# Altium project RCB_WWVB_SDR.PrjPcb (part 1 of 2)
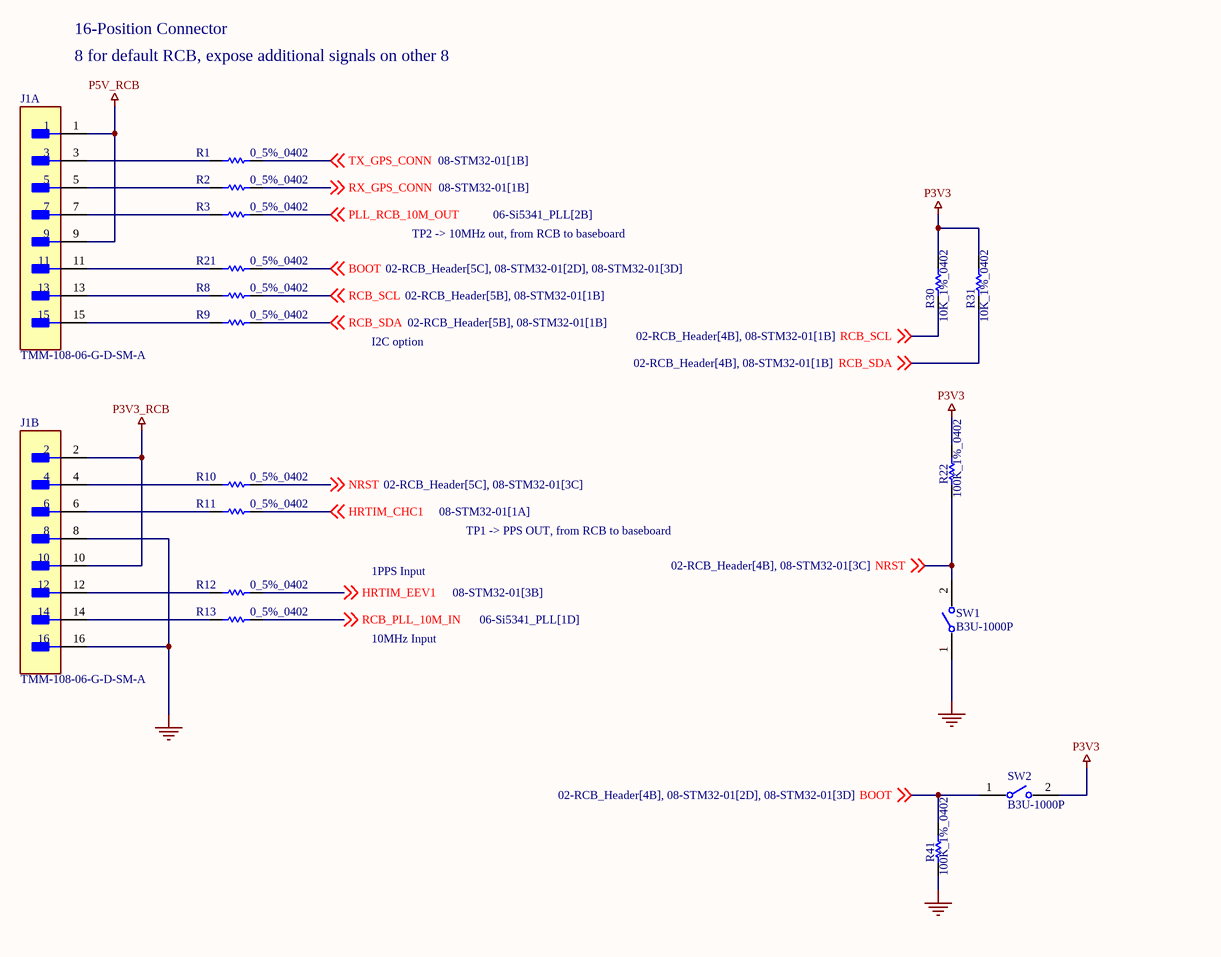
[diagram p0: 02-RCB_Header.SchDoc]
prjCompanyName: Meta Platforms Technologies, LLC.; prjContactAddress1: 9845 Willows Road NE; prjContactAddress2: Redmond, WA 98052; prjContactEmail: Contact Email; prjContactPhone: (...)-...-....; prjElectricalEngineer: Electical Engineer; prjElectricalEngineerEmail: Electical Engineer Email; prjLayoutEngineer: Layout Engineer; prjLayoutEngineerEmail: Layout Engineer Email; prjMechanicalEngineer: Mechanical Engineer; prjMechanicalEngineerEmail: Mechanical Engineer Email; prjPCB_IPN: 844-XXXXX-XX; prjPCB_Name: PCB Name; prjPCB_Revision: X1; prjProjectName: Project Name; prjSchematic_IPN: 846-XXXXX-XX; prjSchematic_Revision: X1; XprjPCBA_IPN: Set v_prjPCBA_IPN in variant parameters; XprjPCBA_Revision: Set v_prjPCBA_Revision in variant parameters
8 sheets, 254 parts. Net scope: global (net labels, ports and power ports of the same name join across sheets).
Board file: RCB_WWVB_SDR_V2.PcbDoc
Sheets:
  02-RCB_Header.SchDoc
  03-WWVB_Path.SchDoc
  04-SX1257.SchDoc
  06-Si5341_PLL.SchDoc
  07-TCXO_Crystal.SchDoc
  09-STM32-02.SchDoc
  11-Ice40_FPGA.SchDoc
  12-Power.SchDoc

## Sheet 02-RCB_Header.SchDoc
size B; SheetNumber: 2; SheetTotal: 12

### Parts
J1  TMM-108-06-G-D-SM-A  [FP-TMM-108-06-G-D-SM-A-MFG]  (parts A,B of 2)
R1  0_5%_0402  [RESC1005X40X25NL05T10]
R2  0_5%_0402  [RESC1005X40X25NL05T10]
R3  0_5%_0402  [RESC1005X40X25NL05T10]
R8  0_5%_0402  [RESC1005X40X25NL05T10]
R9  0_5%_0402  [RESC1005X40X25NL05T10]
R10  0_5%_0402  [RESC1005X40X25NL05T10]
R11  0_5%_0402  [RESC1005X40X25NL05T10]
R12  0_5%_0402  [RESC1005X40X25NL05T10]
R13  0_5%_0402  [RESC1005X40X25NL05T10]
R21  0_5%_0402  [RESC1005X40X25NL05T10]
R22  100K_1%_0402  [RESC1005X40X25ML05T10]
R30  10K_1%_0402  [RESC1005X40X25NL10T10]
R31  10K_1%_0402  [RESC1005X40X25NL10T10]
R41  100K_1%_0402  [RESC1005X40X25ML05T10]
SW1  B3U-1000P  [FP-B3U-1000P-MFG]
SW2  B3U-1000P  [FP-B3U-1000P-MFG]

### Nets
GND: J1.8 J1.16 R41.1 SW1.1
P3V3: R22.2 R30.2 R31.2 SW2.2
P3V3_RCB: J1.2 J1.10
P5V_RCB: J1.1 J1.9
BOOT: R21.2 R41.2 SW2.1 ; off-sheet BOOT
HRTIM_CHC1: R11.2 ; off-sheet HRTIM_CHC1
HRTIM_EEV1: R12.2 ; off-sheet HRTIM_EEV1
NRST: R10.2 R22.1 SW1.2 ; off-sheet NRST
PLL_RCB_10M_OUT: R3.2 ; off-sheet PLL_RCB_10M_OUT
RCB_PLL_10M_IN: R13.2 ; off-sheet RCB_PLL_10M_IN
RCB_SCL: R8.2 R30.1 ; off-sheet RCB_SCL
RCB_SDA: R9.2 R31.1 ; off-sheet RCB_SDA
RX_GPS_CONN: R2.2 ; off-sheet RX_GPS_CONN
TX_GPS_CONN: R1.2 ; off-sheet TX_GPS_CONN
NetJ1_3: J1.3 R1.1
NetJ1_4: J1.4 R10.1
NetJ1_5: J1.5 R2.1
NetJ1_6: J1.6 R11.1
NetJ1_7: J1.7 R3.1
NetJ1_11: J1.11 R21.1
NetJ1_12: J1.12 R12.1
NetJ1_13: J1.13 R8.1
NetJ1_14: J1.14 R13.1
NetJ1_15: J1.15 R9.1

### Notes on the sheet
- 16-Position Connector
- 8 for default RCB, expose additional signals on other 8
- TP2 -> 10MHz out, from RCB to baseboard
- I2C option
- TP1 -> PPS OUT, from RCB to baseboard
- 1PPS Input
- 10MHz Input

### Library data of the parts
J1 = CMP-02766-001527-1: CONN HEADER SMD 16POS 2MM; Max Voltage Rating (AC): 500V; Gender: Male; Number of Contacts: 16; Max Current Rating: 3.9A; RoHS Compliant: Yes; Contact Material: Bronze; Number of Rows: 2; Packaging: Bulk; Length: 16mm; Termination: Solder; Depth: 3.94mm; Max Operating Temperature: 125°C; Housing Color: Black; Radiation Hardening: No; Pitch: 2mm; Orientation: Straight; Contact Plating: Gold; Min Operating Temperature: -55°C; Housing Material: Polymer
R1-R3 R8-R13 R21 = CMP-2002-06457-1: Manufacturer: Panasonic; Part Number: ERJ-U020R00X
R22 R41 = CMP-2002-07852-1: Manufacturer: Yageo; Part Number: RC0402FR-13100KL
R30 R31 = CMP-2002-04694-1: Manufacturer: Bourns; Part Number: CR0402-FX-1002GLF
SW1 SW2 = CMP-2100-03586-2: SWITCH TACTILE SPST-NO 0.05A 12V; Contact Resistance: 100mR; Operating Force: 1.5N; Max Current Rating: 50mA; Switch Travel: 0.15mm; Actuator Type: Standard; Mechanical Life: 200000Cycles; Ratings: Dust Proof; Illumination Type: Non-Illuminated; Throw Configuration: SPST; Actuator Length: 0.4mm; Switch Function: Off-Mom; Height: 1.2mm; Width: 3mm; Weight: 0.000776oz; Contact Material: Silver; Max Voltage Rating (DC): 12V; Insulation Resistance: 100MR; Lead Free: Lead Free; Current Rating: 50mA; Termination: SMD/SMT; Length: 4mm; Voltage Rating (DC): 12V; Contact Current Rating: 50mA; Orientation: Straight; Depth: 2.5mm; Max Operating Temperature: 70°C; Packaging: Tape and Reel; Min Operating Temperature: -25°C; Package Quantity: 1; Mount: Surface Mount; Electrical Life: 200000Cycles

## Sheet 03-WWVB_Path.SchDoc
size B; SheetNumber: 3; SheetTotal: 12
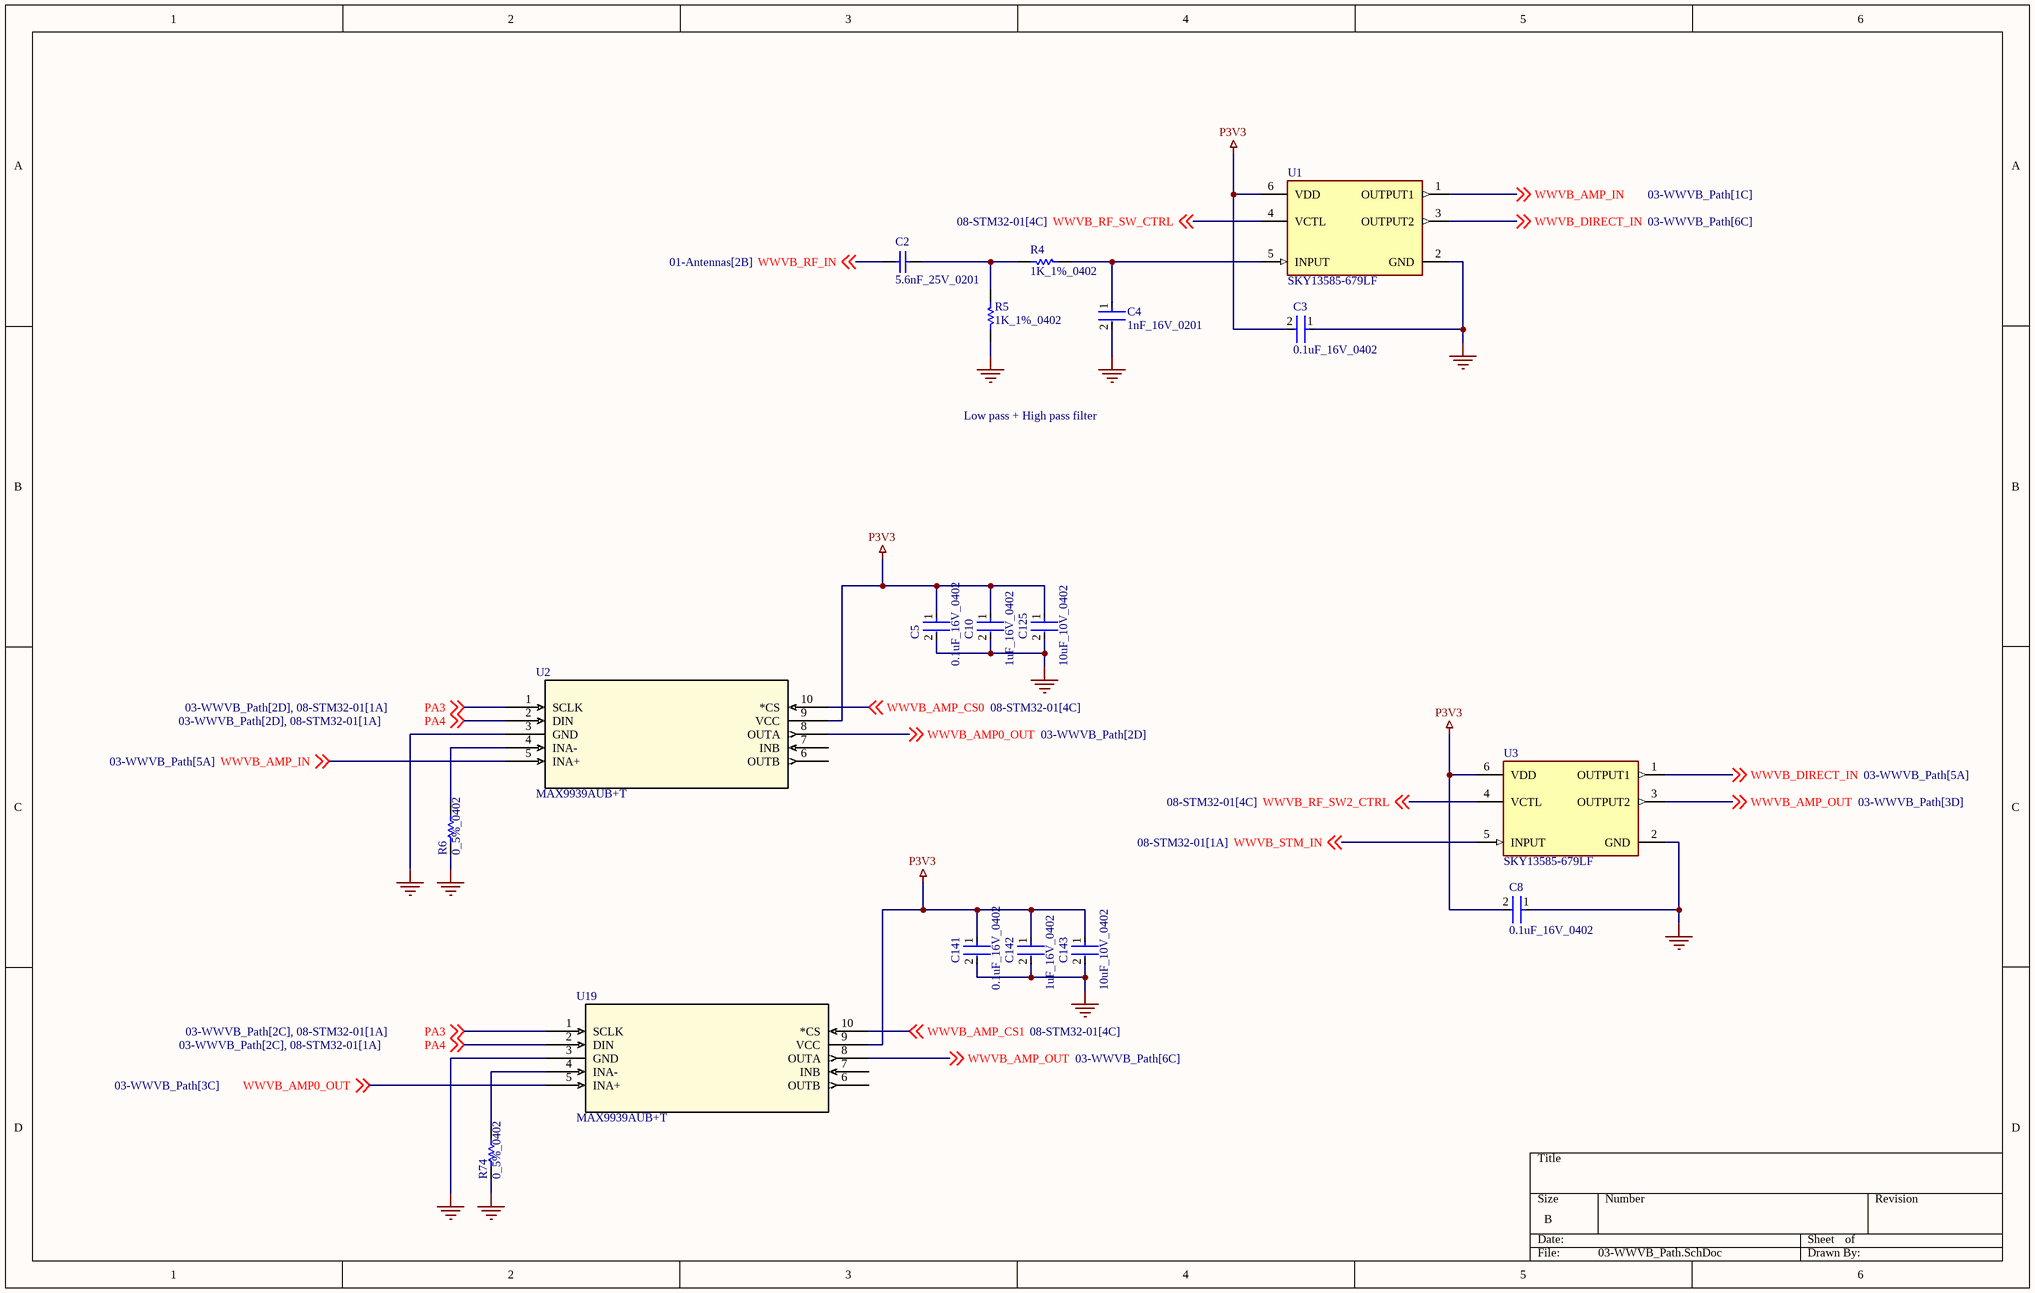
[diagram p1: 03-WWVB_Path.SchDoc]

### Parts
C2  5.6nF_25V_0201  [CAPC0603X33X15ML03T05]
C3  0.1uF_16V_0402  [FP-C0402-BB-MFG]
C4  1nF_16V_0201  [FP-0201-L_0_6_0_09-W_0_3-MFG]
C5  0.1uF_16V_0402  [FP-C0402-BB-MFG]
C8  0.1uF_16V_0402  [FP-C0402-BB-MFG]
C10  1uF_16V_0402  [FP-0402-L_1_0_0_05-W_0_5-IPC_A]
C125  10uF_10V_0402  [FP-CL05A106MP5NUNC-MFG]
C141  0.1uF_16V_0402  [FP-C0402-BB-MFG]
C142  1uF_16V_0402  [FP-0402-L_1_0_0_05-W_0_5-IPC_A]
C143  10uF_10V_0402  [FP-CL05A106MP5NUNC-MFG]
R4  1K_1%_0402  [RESC1005X40X25NL05T05]
R5  1K_1%_0402  [RESC1005X40X25NL05T05]
R6  0_5%_0402  [RESC1005X40X25NL05T10]
R74  0_5%_0402  [RESC1005X40X25NL05T10]
U1  SKY13585-679LF  [FP-SKY13585-679LF-MFG]
U2  MAX9939AUB+T  [21-0061L_MXM]
U3  SKY13585-679LF  [FP-SKY13585-679LF-MFG]
U19  MAX9939AUB+T  [21-0061L_MXM]

### Nets
GND: C3.1 C4.2 C5.2 C8.1 C10.2 C125.2 C141.2 C142.2 C143.2 R5.1 R6.1 R74.1 U1.2(GND) U2.3(GND) U3.2(GND) U19.3(GND)
P3V3: C3.2 C5.1 C8.2 C10.1 C125.1 C141.1 C142.1 C143.1 U1.6(VDD) U2.9(VCC) U3.6(VDD) U19.9(VCC)
PA3: U2.1(SCLK) U19.1(SCLK) ; off-sheet PA3
PA4: U2.2(DIN) U19.2(DIN) ; off-sheet PA4
WWVB_AMP0_OUT: U2.8(OUTA) U19.5(INA+) ; off-sheet WWVB_AMP0_OUT
WWVB_AMP_CS0: U2.10(*CS) ; off-sheet WWVB_AMP_CS0
WWVB_AMP_CS1: U19.10(*CS) ; off-sheet WWVB_AMP_CS1
WWVB_AMP_IN: U1.1(OUTPUT1) U2.5(INA+) ; off-sheet WWVB_AMP_IN
WWVB_AMP_OUT: U3.3(OUTPUT2) U19.8(OUTA) ; off-sheet WWVB_AMP_OUT
WWVB_DIRECT_IN: U1.3(OUTPUT2) U3.1(OUTPUT1) ; off-sheet WWVB_DIRECT_IN
WWVB_RF_IN: C2.1 ; off-sheet WWVB_RF_IN
WWVB_RF_SW2_CTRL: U3.4(VCTL) ; off-sheet WWVB_RF_SW2_CTRL
WWVB_RF_SW_CTRL: U1.4(VCTL) ; off-sheet WWVB_RF_SW_CTRL
WWVB_STM_IN: U3.5(INPUT) ; off-sheet WWVB_STM_IN
NetC2_2: C2.2 R4.2 R5.2
NetC4_1: C4.1 R4.1 U1.5(INPUT)
NetR6_2: R6.2 U2.4(INA-)
NetR74_2: R74.2 U19.4(INA-)

Not connected (* = marked no-connect by the designer): U2 6(OUTB) 7(INB); U19 6(OUTB) 7(INB)

### Notes on the sheet
- Low pass + High pass filter

### Library data of the parts
C2 = CMP-2010-01745-1: Part Number: MC000322; Manufacturer: Multicomp
C3 C5 C8 C141 = CMP-1034-02068-3: CAP CER 0.1UF 16V 5% X7R 0402; Manufacturer: Kemet; Manufacturer Part Number: C0402C104J4RACTU; Value: 0.10 μF; Temperature Coefficient: 15%; Tolerance: 0.05; Material: Ceramic; ComponentLink2URL: https://content.kemet.com/datasheets/KEM_C1002_X7R_SMD.pdf; Automotive: No; Device Class L2: Capacitors; Temperature: -55°C to +125°C; RoHS: TRUE; Voltage Rating: 16 V; ComponentLink2Description: Datasheet; Device Class L3: Ceramic Capacitors; Temperature Range Low: -55°C; Ipc Land Pattern Name: CAPC10050X50; Device Class L1: Passive Components; Temperature Range High: +125°C; Package: C0402-BB; Capacitance: 0.10 μF; Category: Cap; Mouser Description: CAP CER 0.1UF 16V X7R 0402; Height: 0.55mm; Digikey Description: CAP CER 0.1UF 16V 5% X7R 0402; Octopart: https://octopart.com/c0402c104j4ractu-kemet-12573893; Temperature Characteristic: X7R; Lead Free: Yes
C4 = CMP-2010-00182-2: General Purpose Ceramic Capacitor, 0201, 1nF, 10%, X7R, 15%, 16V; Dissipation Factor: 12.5%; Insulation Resistance: 100GR; Lead Free: Lead Free; Thickness: 0.013inch; Height: 0.33mm; Dielectric: X7R; Voltage Rating: 16V; Max Operating Temperature: 125°C; RoHS Compliant: Yes; Voltage: 16V; Package Quantity: 1; Mount: Surface Mount; Voltage Rating (DC): 16V; Dielectric Material: Ceramic; Termination: SMD/SMT; REACH SVHC: No SVHC; Case Code (Metric): 0603; Length: 0.6mm; Case/Package: 0201; Width: 0.012inch; Case Code (Imperial): 0201; Radiation Hardening: No; Tolerance: 10%; Series: -; Number of Pins: 2; Min Operating Temperature: -55°C; Capacitance: 1nF; Construction: Flat; Depth: 0.3mm; Packaging: Tape and Reel
C10 C142 = CMP-14477-000104-2: None; Tolerance: 10%; Voltage Rating: 16V; Dielectric: X5R; Capacitance: 1uF; Packaging: Tape and Reel; Depth: 0.5mm; Mount: Surface Mount; Thickness: 0.022inch; Package Quantity: 1; Min Operating Temperature: -55°C; Series: M; Voltage Rating (DC): 16V; Termination: SMD/SMT; Case/Package: 0402; Number of Pins: 2; Case Code (Imperial): 0402; Length: 1mm; Halogen Free: Halogen Free; Case Code (Metric): 1005; Width: 0.02inch; RoHS Compliant: Yes; Radiation Hardening: No; Max Operating Temperature: 85°C; Height: 0.5mm; Construction: Flat
C125 C143 = CMP-13271-000002-1: CAP CER 10UF 10V X5R 0402; Manufacturer Part Number: CL05A106MP5NUNC; Manufacturer: Samsung; Temperature Coefficient: 15%; Tolerance: 20%; Material: Ceramic; Octopart: https://octopart.com/cl05a106mp5nunc-samsung-22457395; Voltage Rating: 10V; RoHS: TRUE; Value: 10uF; Height: 0.7mm; Digikey Description: CAP CER 10UF 10V X5R 0402; Automotive: No; Package: CL05A106MP5NUNC; Device Class L1: Passive Components; Capacitance: 10uF; Temperature Range High: +85°C; ComponentLink2Description: Datasheet; Device Class L2: Capacitors; Temperature Characteristic: X5R; Temperature: -55°C to +85°C; ComponentLink2URL: http://www.samsungsem.com/kr/support/product-search/mlcc/__icsFiles/afieldfile/2019/05/10/19-CL05A106MP5NUNC.pdf; Device Class L3: Ceramic Capacitors; Category: Cap; Temperature Range Low: -55°C; Ipc Land Pattern Name: CAPC10050X50; Lead Free: Yes
R4 R5 = CMP-2002-08277-1: Manufacturer: Vishay Dale; Part Number: CRCW04021K00FKTD
R6 R74 = CMP-2002-06457-1: as R1 on sheet 02-RCB_Header
U1 U3 = CMP-85923-000009-1: IC RF SWITCH SPDT 6GHZ 6MLPD; Insertion Loss: 0.5dB; Impedance: 50R; IIP3: 56dBm; Test Frequency: 2.5GHz; Packaging: Cut Tape; Throw Configuration: SPDT; Max Operating Temperature: 90°C; RoHS Compliant: Yes; Min Operating Temperature: -40°C; Series: -
U2 U19 = MAX9939AUB+T: No Description Available; Mfr_Name: Analog Devices Inc; Copyright: Copyright (C) 2023 Ultra Librarian. All rights reserved.; Manufacturer_Part_Number: MAX9939AUB+T; RefDes: RefDes; Type: DEV

## Sheet 04-SX1257.SchDoc
size B; SheetNumber: 4; SheetTotal: 12
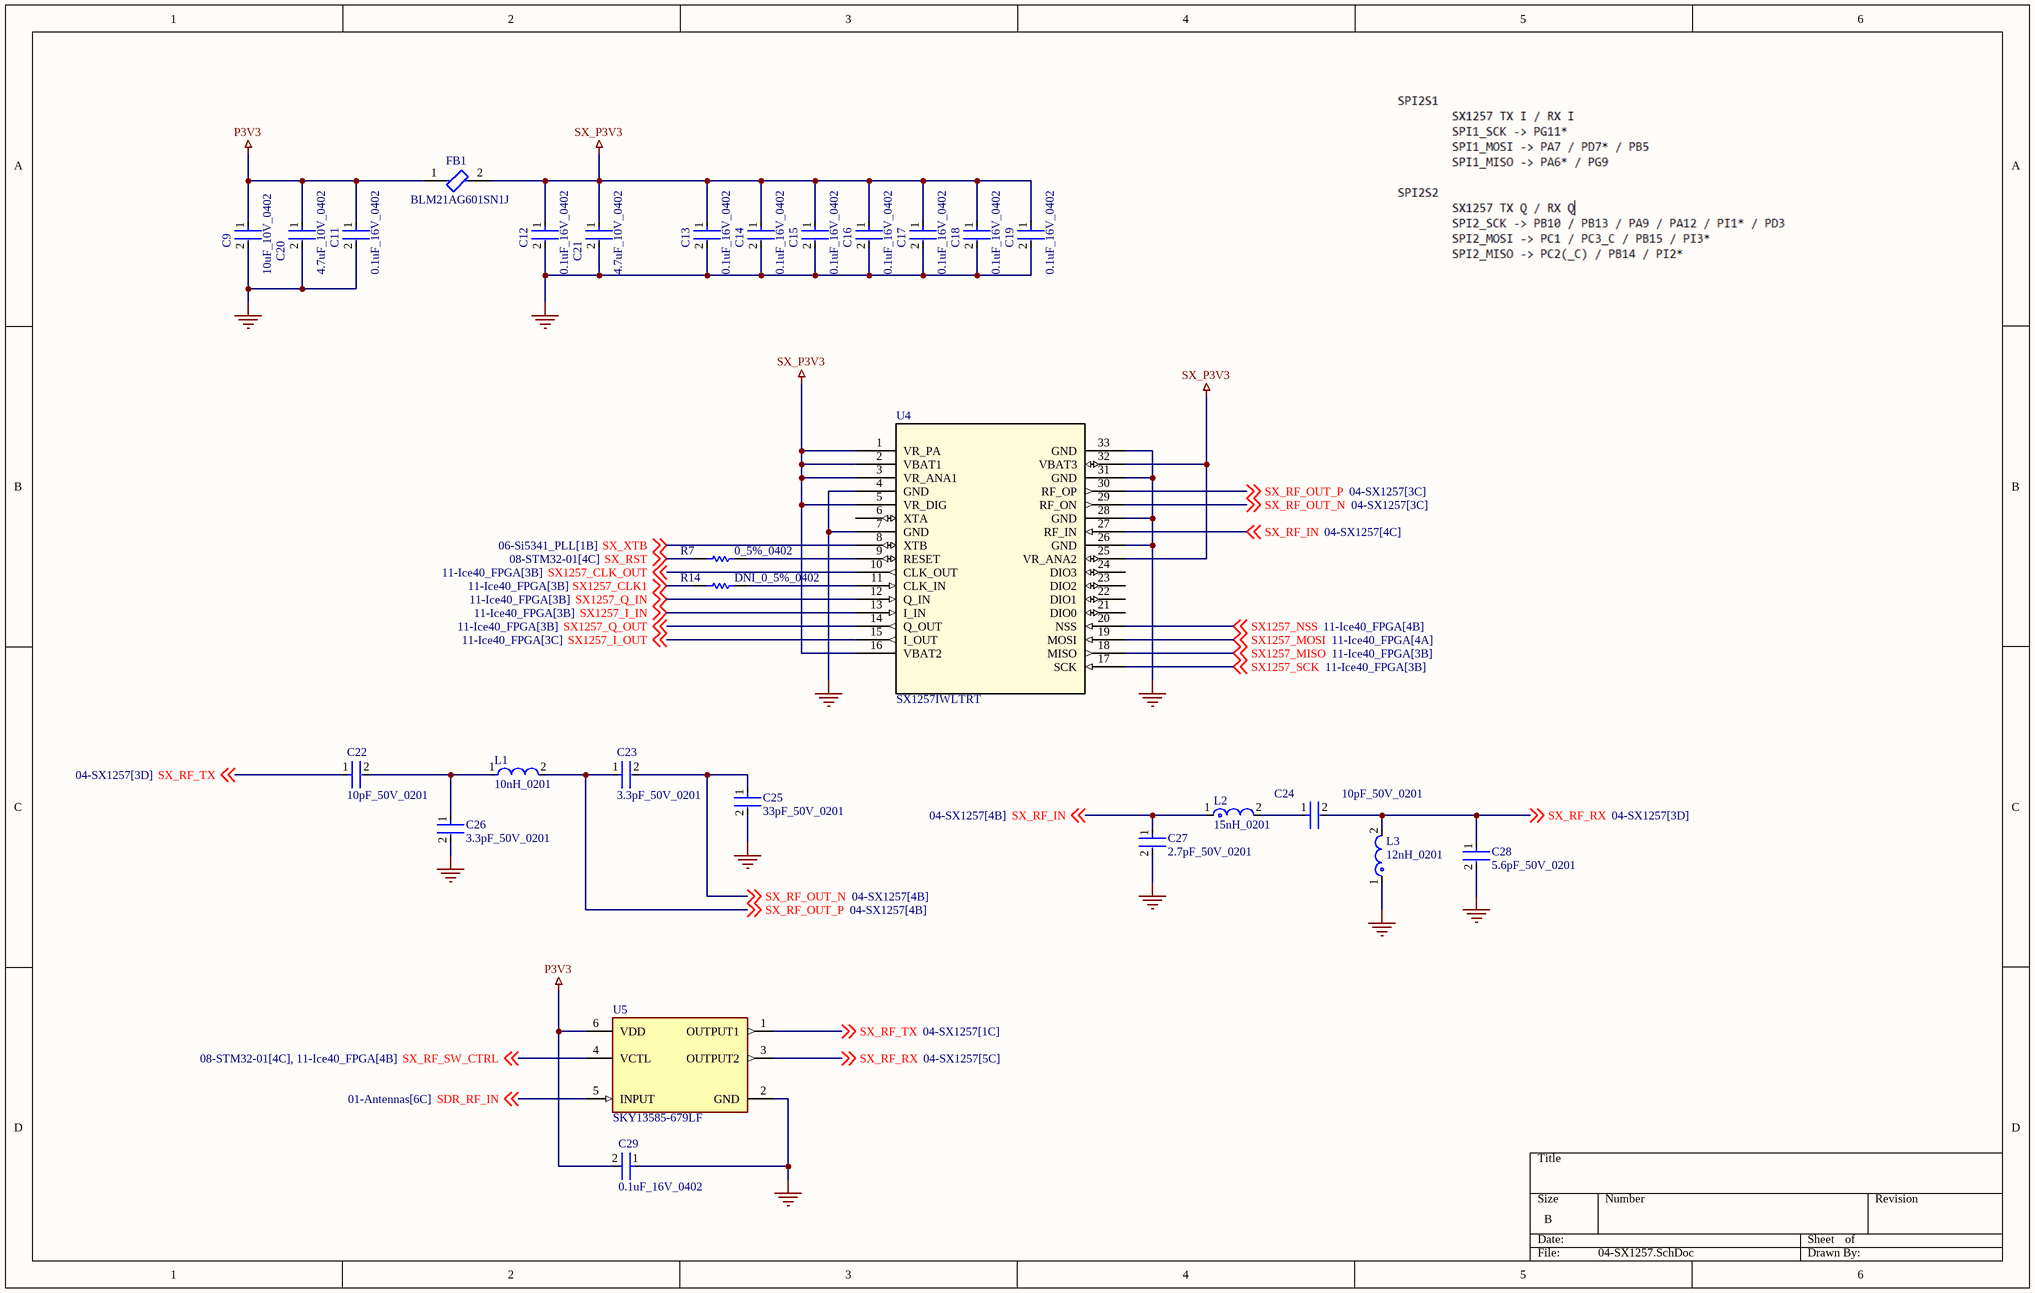
[diagram p2: 04-SX1257.SchDoc]

### Parts
C9  10uF_10V_0402  [FP-CL05A106MP5NUNC-MFG]
C11  0.1uF_16V_0402  [FP-C0402-BB-MFG]
C12  0.1uF_16V_0402  [FP-C0402-BB-MFG]
C13  0.1uF_16V_0402  [FP-C0402-BB-MFG]
C14  0.1uF_16V_0402  [FP-C0402-BB-MFG]
C15  0.1uF_16V_0402  [FP-C0402-BB-MFG]
C16  0.1uF_16V_0402  [FP-C0402-BB-MFG]
C17  0.1uF_16V_0402  [FP-C0402-BB-MFG]
C18  0.1uF_16V_0402  [FP-C0402-BB-MFG]
C19  0.1uF_16V_0402  [FP-C0402-BB-MFG]
C20  4.7uF_10V_0402  [FP-C1005-050-0_15-MFG]
C21  4.7uF_10V_0402  [FP-C1005-050-0_15-MFG]
C22  10pF_50V_0201  [FP-CGA1A-0_1-0_03-MFG]
C23  3.3pF_50V_0201  [FP-GRM033-0_03-IPC_C]
C24  10pF_50V_0201  [FP-CGA1A-0_1-0_03-MFG]
C25  33pF_50V_0201  [FP-CGA1A-0_1-0_03-MFG]
C26  3.3pF_50V_0201  [FP-GRM033-0_03-IPC_C]
C27  2.7pF_50V_0201  [FP-GRM033-0_03-IPC_C]
C28  5.6pF_50V_0201  [FP-GRM033-0_03-MFG]
C29  0.1uF_16V_0402  [FP-C0402-BB-MFG]
FB1  BLM21AG601SN1J  [FP-BLM21-0_2-t0_85-e0_5-IPC_A]
L1  10nH_0201  [FP-LQP03HQ_02-MFG]
L2  15nH_0201  [FP-LQP03TG_02-IPC_C]
L3  12nH_0201  [FP-LQP03TG_02-MFG]
R7  0_5%_0402  [RESC1005X40X25NL05T10]
R14  DNI_0_5%_0402  [RESC1005X40X25NL05T10]  (no BOM)
U4  SX1257IWLTRT  [MLPQW-32_SEM]
U5  SKY13585-679LF  [FP-SKY13585-679LF-MFG]

### Nets
GND: C9.2 C11.2 C12.2 C13.2 C14.2 C15.2 C16.2 C17.2 C18.2 C19.2 C20.2 C21.2 C25.2 C26.2 C27.2 C28.2 C29.1 L3.1 U4.4(GND) U4.7(GND) U4.26(GND) U4.28(GND) U4.31(GND) U4.33(GND) U5.2(GND)
P3V3: C9.1 C11.1 C20.1 C29.2 FB1.1 U5.6(VDD)
SX_P3V3: C12.1 C13.1 C14.1 C15.1 C16.1 C17.1 C18.1 C19.1 C21.1 FB1.2 U4.1(VR_PA) U4.2(VBAT1) U4.3(VR_ANA1) U4.5(VR_DIG) U4.16(VBAT2) U4.25(VR_ANA2) U4.32(VBAT3)
SDR_RF_IN: U5.5(INPUT) ; off-sheet SDR_RF_IN
SX1257_CLK1: R14.1 ; off-sheet SX1257_CLK1
SX1257_CLK_OUT: U4.10(CLK_OUT) ; off-sheet SX1257_CLK_OUT
SX1257_I_IN: U4.13(I_IN) ; off-sheet SX1257_I_IN
SX1257_I_OUT: U4.15(I_OUT) ; off-sheet SX1257_I_OUT
SX1257_MISO: U4.18(MISO) ; off-sheet SX1257_MISO
SX1257_MOSI: U4.19(MOSI) ; off-sheet SX1257_MOSI
SX1257_NSS: U4.20(NSS) ; off-sheet SX1257_NSS
SX1257_Q_IN: U4.12(Q_IN) ; off-sheet SX1257_Q_IN
SX1257_Q_OUT: U4.14(Q_OUT) ; off-sheet SX1257_Q_OUT
SX1257_SCK: U4.17(SCK) ; off-sheet SX1257_SCK
SX_RF_IN: C27.1 L2.1 U4.27(RF_IN) ; off-sheet SX_RF_IN
SX_RF_OUT_N: C23.2 C25.1 U4.29(RF_ON) ; off-sheet SX_RF_OUT_N
SX_RF_OUT_P: C23.1 L1.2 U4.30(RF_OP) ; off-sheet SX_RF_OUT_P
SX_RF_RX: C24.2 C28.1 L3.2 U5.3(OUTPUT2) ; off-sheet SX_RF_RX
SX_RF_SW_CTRL: U5.4(VCTL) ; off-sheet SX_RF_SW_CTRL
SX_RF_TX: C22.1 U5.1(OUTPUT1) ; off-sheet SX_RF_TX
SX_RST: R7.1 ; off-sheet SX_RST
SX_XTB: U4.8(XTB) ; off-sheet SX_XTB
NetC22_2: C22.2 C26.1 L1.1
NetC24_1: C24.1 L2.2
NetR7_2: R7.2 U4.9(RESET)
NetR14_2: R14.2 U4.11(CLK_IN)

Not connected (* = marked no-connect by the designer): U4 6(XTA) 21(DIO0) 22(DIO1) 23(DIO2) 24(DIO3)

### Library data of the parts
C9 = CMP-13271-000002-1: as C125 on sheet 03-WWVB_Path; Octopart: https://octopart.com/cl05a106mp5nunc-samsung-22457395; Voltage Rating: 10V; RoHS: TRUE; Value: 10uF; Height: 0.7mm; Digikey Description: CAP CER 10UF 10V X5R 0402; Automotive: No; Package: CL05A106MP5NUNC; Device Class L1: Passive Components; Capacitance: 10uF; Temperature Range High: +85°C; ComponentLink2Description: Datasheet; Device Class L2: Capacitors; Temperature Characteristic: X5R; Temperature: -55°C to +85°C; ComponentLink2URL: http://www.samsungsem.com/kr/support/product-search/mlcc/__icsFiles/afieldfile/2019/05/10/19-CL05A106MP5NUNC.pdf; Device Class L3: Ceramic Capacitors; Category: Cap; Temperature Range Low: -55°C; Ipc Land Pattern Name: CAPC10050X50; Lead Free: Yes
C11-C19 C29 = CMP-1034-02068-3: as C3 on sheet 03-WWVB_Path; ComponentLink2URL: https://content.kemet.com/datasheets/KEM_C1002_X7R_SMD.pdf; Automotive: No; Device Class L2: Capacitors; Temperature: -55°C to +125°C; RoHS: TRUE; Voltage Rating: 16 V; ComponentLink2Description: Datasheet; Device Class L3: Ceramic Capacitors; Temperature Range Low: -55°C; Ipc Land Pattern Name: CAPC10050X50; Device Class L1: Passive Components; Temperature Range High: +125°C; Package: C0402-BB; Capacitance: 0.10 μF; Category: Cap; Mouser Description: CAP CER 0.1UF 16V X7R 0402; Height: 0.55mm; Digikey Description: CAP CER 0.1UF 16V 5% X7R 0402; Octopart: https://octopart.com/c0402c104j4ractu-kemet-12573893; Temperature Characteristic: X7R; Lead Free: Yes
C20 C21 = CMP-2000-05997-2: CAP CER 4.7UF 10V X5R 0402; Dielectric Material: Ceramic; Tolerance: 10%; Series: C; Package Quantity: 10000; Max Operating Temperature: 85°C; Case Code (Imperial): 0402; Lead Free: Lead Free; Voltage Rating (DC): 10V; Packaging: Cut Tape; Voltage Rating: 10V; Min Operating Temperature: -55°C; Dielectric: X5R; Thickness: 0.022inch; Width: 0.02inch; Case/Package: 0402; Case Code (Metric): 1005; Capacitance: 4.7uF; Length: 0.039inch; RoHS Compliant: Yes; REACH SVHC: No SVHC; Mount: Surface Mount
C22 C24 = CMP-08246-000166-1: Cap Ceramic 10pF 50V C0G 0.5pF Pad SMD 0201 125°C Automotive T/R; Ratings: AEC-Q200; Length: 0.6mm; Height: 0.3mm; Case Code (Imperial): 0201; Package Quantity: 1; Dielectric: C0G; Max Operating Temperature: 125°C; Case Code (Metric): 0603; Packaging: Tape and Reel; Composition: Ceramic; Mount: Surface Mount; Depth: 0.3mm; Min Operating Temperature: -55°C; Voltage Rating (DC): 50V; Case/Package: 0201; Voltage Rating: 50V; Thickness: 0.013inch; Termination: SMD/SMT; Capacitance: 10pF; Width: 0.012inch; Weight: 6E-06oz
C23 C26 = CMP-2010-01117-2: Chip Multilayer Ceramic Capacitors for General Purpose, 0201, 3.3pF, C0G, 30ppm/°C, 0.25pF, 50V; Length: 0.024inch; Dielectric: C0G; Case Code (Imperial): 0201; Min Operating Temperature: -55°C; Mount: Surface Mount; Package Quantity: 50000; Case/Package: 0201; Voltage Rating: 50V; Termination: SMD/SMT; Thickness: 0.013inch; Width: 0.012inch; Capacitance: 3.3pF; Max Operating Temperature: 125°C; Voltage Rating (DC): 50V; Height: 0.3mm; Case Code (Metric): 0603; Packaging: Tape and Reel
C25 = CMP-08246-002436-1: Cap Ceramic 33pF 50V C0G 5% Pad SMD 0201 125°C Automotive T/R; Width: 0.012inch; Height: 0.3mm; Case Code (Imperial): 0201; Depth: 0.3mm; Weight: 6E-06oz; Package Quantity: 1; Mount: Surface Mount; Thickness: 0.013inch; Composition: Ceramic; Packaging: Tape and Reel; Dielectric: C0G; Capacitance: 33pF; Case Code (Metric): 0603; Tolerance: 5%; Length: 0.6mm; Termination: SMD/SMT; Max Operating Temperature: 125°C; Voltage Rating (DC): 50V; Ratings: AEC-Q200; Voltage Rating: 50V; Case/Package: 0201; Min Operating Temperature: -55°C
C27 = CMP-2010-01540-2: Chip Multilayer Ceramic Capacitors for General Purpose, 0201, 2.7pF, C0G, 30ppm/°C, 0.25pF, 50V; Package Quantity: 15000; Max Operating Temperature: 125°C; Dielectric: C0G; Height: 0.3mm; Voltage Rating: 50V; Packaging: Tape and Reel; Length: 0.024inch; Width: 0.012inch; Thickness: 0.013inch; Mount: Surface Mount; Case/Package: 0201; Voltage Rating (DC): 50V; Min Operating Temperature: -55°C; Case Code (Metric): 0603; Case Code (Imperial): 0201; Termination: SMD/SMT; Capacitance: 2.7pF; Lead Free: Lead Free
C28 = CMP-2010-01150-2: Chip Multilayer Ceramic Capacitors for General Purpose, 0201, 5.6pF, C0G, 30ppm/°C, 0.1pF, 50V; Depth: 0.3mm; Length: 0.6mm; Max Operating Temperature: 125°C; Mount: Surface Mount; Width: 0.012inch; Min Operating Temperature: -55°C; Case/Package: 0201; Capacitance: 5.6pF; Dielectric: C0G; Height: 0.3mm; Case Code (Imperial): 0201; Termination: SMD/SMT; Package Quantity: 15000; Case Code (Metric): 0603; Voltage Rating: 50V; Voltage Rating (DC): 50V; Thickness: 0.013inch; Packaging: Tape and Reel
FB1 = CMP-0686-00643-3: Chip Ferrite Bead, 0805, 600Ω @ 100MHz, 0.2Ω, 25%, 700mA; Current Rating: 600mA; Impedance: 600R; DC Resistance (DCR): 210mR; Max Current Rating: 200mA; Number of Circuits: 1; RoHS Compliant: Yes; Test Frequency: 100MHz; Number of Pins: 2; Case Code (Metric): 2012; Depth: 0.85mm; Height: 1.25mm; Case Code (Imperial): 0805; Case/Package: 0805; DC Current: 200mA; Max Operating Temperature: 125°C; Core Material: Ferrite; Length: 2.2mm; Tolerance: 25%; Packaging: Tape and Reel; Min Operating Temperature: -55°C; Radiation Hardening: No; Termination: Flat
L1 = CMP-06042-008104-1: Film type RF Inductor 10nH ±3% 300mA 0.4Ω 0201 (0603); Test Frequency: 500MHz; Shielding: Unshielded; Core Material: Non-Magnetic; DC Resistance (DCR): 400mR; Self Resonant Frequency: 4.5GHz; Packaging: Tape and Reel; Resistor Type: Thin Film; Min Operating Temperature: -55°C; Tolerance: 3%; Case Code (Imperial): 0201; Current Rating: 300mA; Case/Package: 0201; Max Operating Temperature: 125°C; Mount: Surface Mount; Case Code (Metric): 0603; Inductance: 10nH
L2 = CMP-06042-000019-2: Film type RF Inductor 15nH ±5% 250mA 0.7Ω 0201 (0603); Core Material: Non-Magnetic; Shielding: Unshielded; Q Factor: 12; Self Resonant Frequency: 2.6GHz; DC Resistance (DCR): 700mR; Test Frequency: 500MHz; Lead Free: Lead Free; Military Standard: Not; Case Code (Metric): 0603; Tolerance: 5%; Width: 0.3mm; Case/Package: 0201; DC Current: 250mA; Max DC Current: 250mA; Min Operating Temperature: -55°C; Inductance: 15nH; Packaging: Tape and Reel; Depth: 0.33mm; Height: 0.3mm; Termination: SMD/SMT; Package Quantity: 15000; Resistor Type: Thin Film; Case Code (Imperial): 0201; Max Operating Temperature: 125°C; Current Rating: 250mA; Height - Seated (Max): 0.013inch; Mount: Surface Mount; Length: 0.024inch
L3 = CMP-06042-011957-1: Film type RF Inductor 12nH ±5% 250mA 0.7Ω 0201 (0603); Shielding: Unshielded; Test Frequency: 500MHz; Q Factor: 12; Self Resonant Frequency: 2.9GHz; Core Material: Non-Magnetic; DC Resistance (DCR): 700mR; Package Quantity: 15000; Case/Package: 0201; Military Standard: Not; Max Operating Temperature: 125°C; Tolerance: 5%; Height - Seated (Max): 0.013inch; Case Code (Imperial): 0201; Inductance: 12nH; DC Current: 250mA; Depth: 0.33mm; Resistor Type: Thin Film; Length: 0.024inch; Lead Free: Lead Free; Radiation Hardening: No; Height: 0.3mm; Case Code (Metric): 0603; Width: 0.012inch; Mount: Surface Mount; Max DC Current: 250mA; Current Rating: 250mA; Min Operating Temperature: -55°C; Termination: SMD/SMT; Packaging: Tape and Reel
R7 R14 = CMP-2002-06457-1: as R1 on sheet 02-RCB_Header
U4 = SX1257IWLTRT: No Description Available; Mfr_Name: Semtech; Type: DEV; Copyright: Copyright (C) 2023 Ultra Librarian. All rights reserved.; Manufacturer_Part_Number: SX1257IWLTRT; RefDes: RefDes
U5 = CMP-85923-000009-1: as U1 on sheet 03-WWVB_Path; Packaging: Cut Tape; Throw Configuration: SPDT; Max Operating Temperature: 90°C; RoHS Compliant: Yes; Min Operating Temperature: -40°C; Series: -

## Sheet 06-Si5341_PLL.SchDoc
size B; SheetNumber: 6; SheetTotal: 12
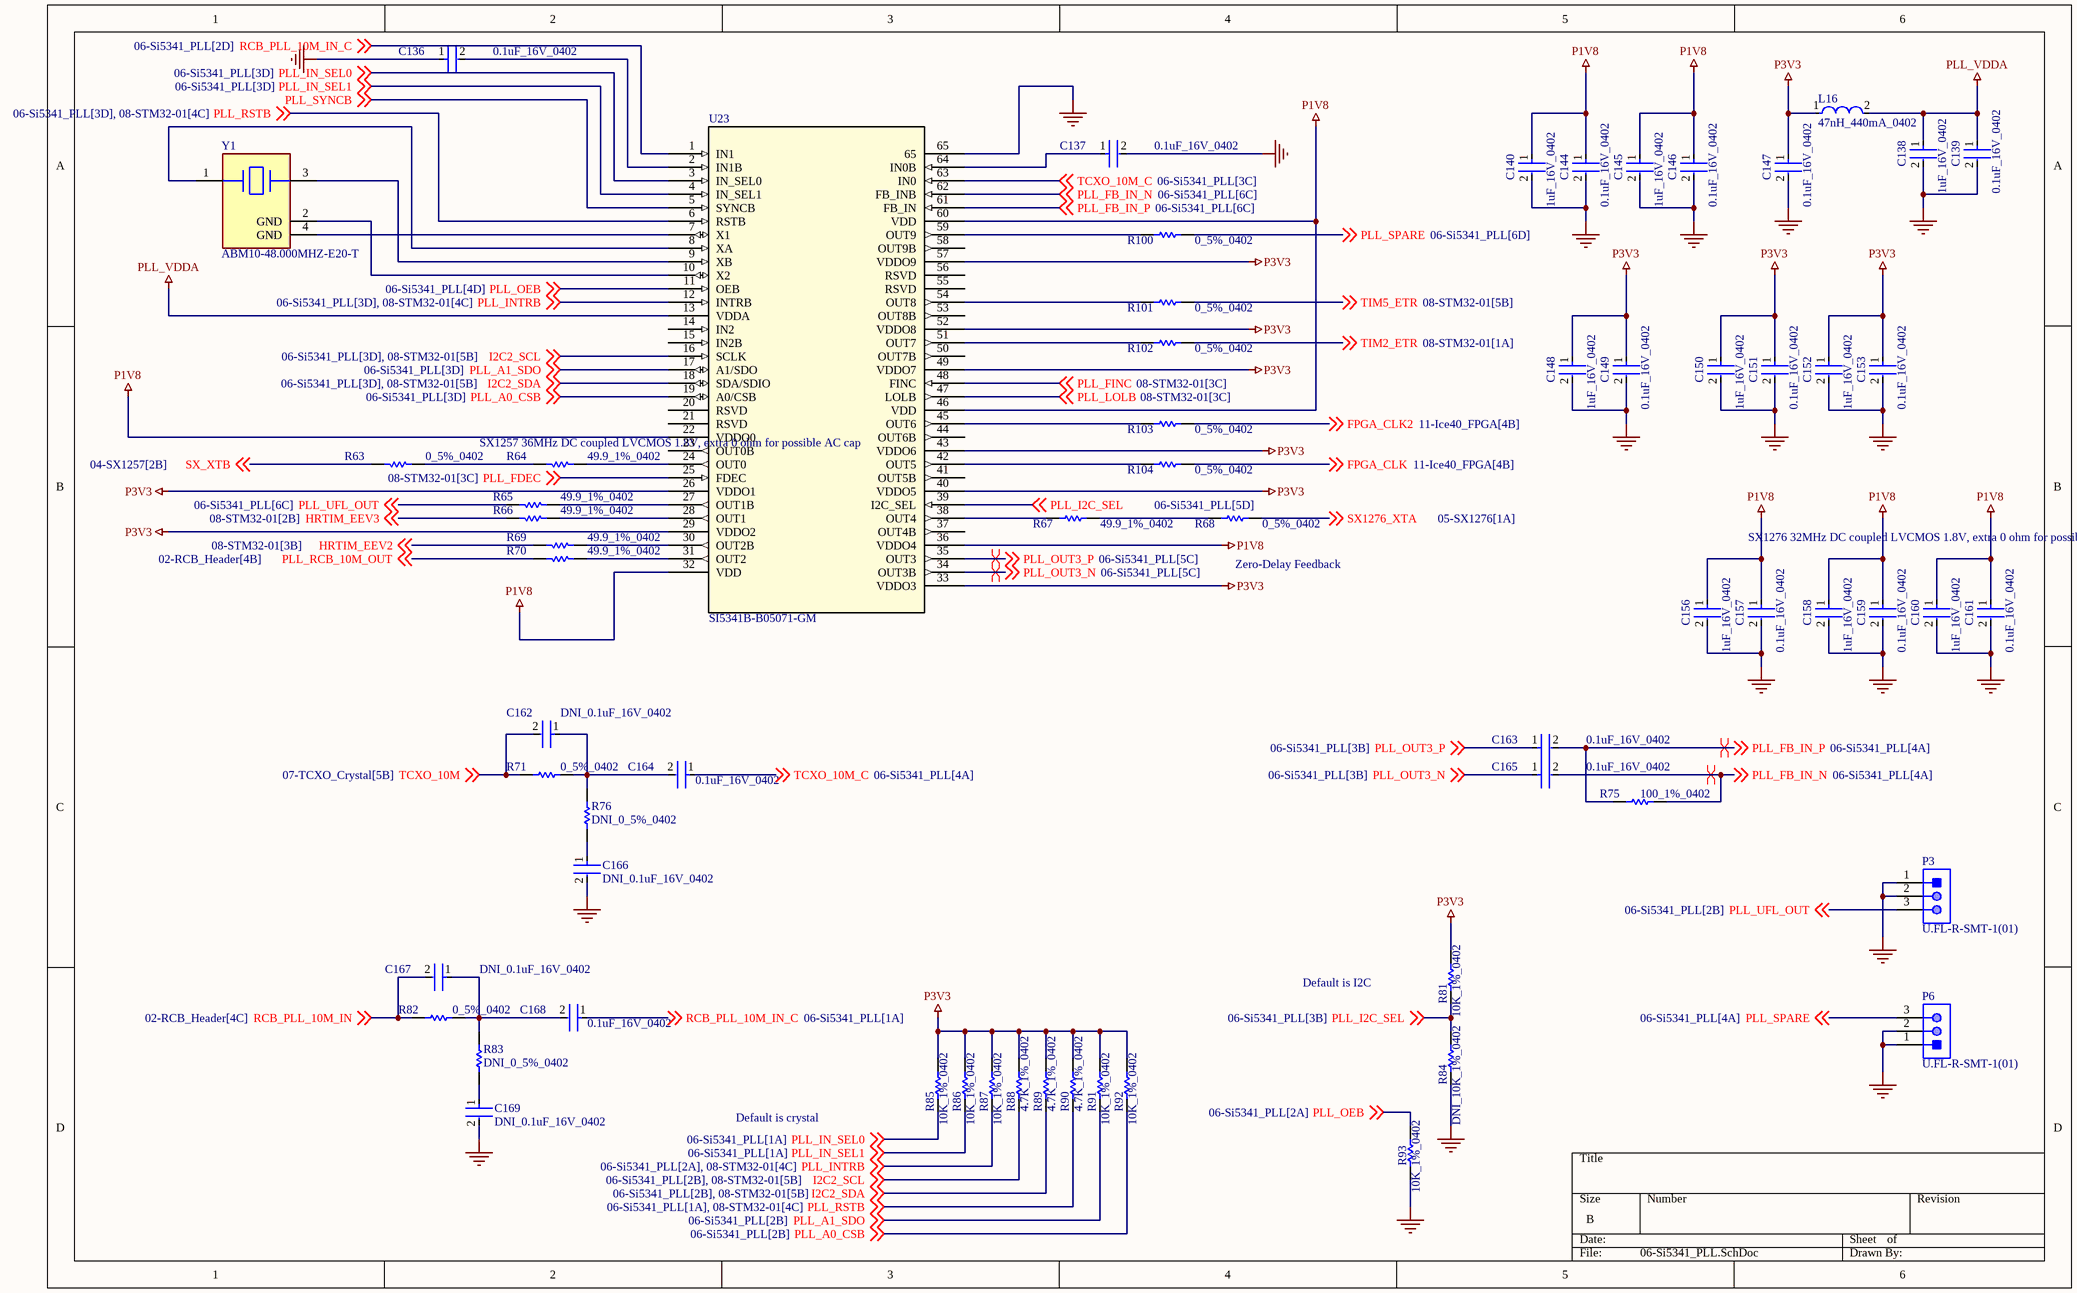
[diagram p3: 06-Si5341_PLL.SchDoc]

### Parts
C136  0.1uF_16V_0402  [FP-C0402-BB-MFG]
C137  0.1uF_16V_0402  [FP-C0402-BB-MFG]
C138  1uF_16V_0402  [FP-0402-L_1_0_0_05-W_0_5-IPC_A]
C139  0.1uF_16V_0402  [FP-C0402-BB-MFG]
C140  1uF_16V_0402  [FP-0402-L_1_0_0_05-W_0_5-IPC_A]
C144  0.1uF_16V_0402  [FP-C0402-BB-MFG]
C145  1uF_16V_0402  [FP-0402-L_1_0_0_05-W_0_5-IPC_A]
C146  0.1uF_16V_0402  [FP-C0402-BB-MFG]
C147  0.1uF_16V_0402  [FP-C0402-BB-MFG]
C148  1uF_16V_0402  [FP-0402-L_1_0_0_05-W_0_5-IPC_A]
C149  0.1uF_16V_0402  [FP-C0402-BB-MFG]
C150  1uF_16V_0402  [FP-0402-L_1_0_0_05-W_0_5-IPC_A]
C151  0.1uF_16V_0402  [FP-C0402-BB-MFG]
C152  1uF_16V_0402  [FP-0402-L_1_0_0_05-W_0_5-IPC_A]
C153  0.1uF_16V_0402  [FP-C0402-BB-MFG]
C156  1uF_16V_0402  [FP-0402-L_1_0_0_05-W_0_5-IPC_A]
C157  0.1uF_16V_0402  [FP-C0402-BB-MFG]
C158  1uF_16V_0402  [FP-0402-L_1_0_0_05-W_0_5-IPC_A]
C159  0.1uF_16V_0402  [FP-C0402-BB-MFG]
C160  1uF_16V_0402  [FP-0402-L_1_0_0_05-W_0_5-IPC_A]
C161  0.1uF_16V_0402  [FP-C0402-BB-MFG]
C162  DNI_0.1uF_16V_0402  [FP-C0402-BB-MFG]  (no BOM)
C163  0.1uF_16V_0402  [FP-C0402-BB-MFG]
C164  0.1uF_16V_0402  [FP-C0402-BB-MFG]
C165  0.1uF_16V_0402  [FP-C0402-BB-MFG]
C166  DNI_0.1uF_16V_0402  [FP-C0402-BB-MFG]  (no BOM)
C167  DNI_0.1uF_16V_0402  [FP-C0402-BB-MFG]  (no BOM)
C168  0.1uF_16V_0402  [FP-C0402-BB-MFG]
C169  DNI_0.1uF_16V_0402  [FP-C0402-BB-MFG]  (no BOM)
L16  47nH_440mA_0402  [FP-LQW15AN_80-MFG]
P3  U.FL-R-SMT-1(01)  [HRS-U.FL-R-SMT-3_V]
P6  U.FL-R-SMT-1(01)  [HRS-U.FL-R-SMT-3_V]
R63  0_5%_0402  [RESC1005X40X25NL05T10]
R64  49.9_1%_0402  [RESC1005X40X25NL10T10]
R65  49.9_1%_0402  [RESC1005X40X25NL10T10]
R66  49.9_1%_0402  [RESC1005X40X25NL10T10]
R67  49.9_1%_0402  [RESC1005X40X25NL10T10]
R68  0_5%_0402  [RESC1005X40X25NL05T10]
R69  49.9_1%_0402  [RESC1005X40X25NL10T10]
R70  49.9_1%_0402  [RESC1005X40X25NL10T10]
R71  0_5%_0402  [RESC1005X40X25NL05T10]
R75  100_1%_0402  [RESC1005X40X25NL05T10]
R76  DNI_0_5%_0402  [RESC1005X40X25NL05T10]  (no BOM)
R81  10K_1%_0402  [RESC1005X40X25NL10T10]
R82  0_5%_0402  [RESC1005X40X25NL05T10]
R83  DNI_0_5%_0402  [RESC1005X40X25NL05T10]  (no BOM)
R84  DNI_10K_1%_0402  [RESC1005X40X25NL10T10]  (no BOM)
R85  10K_1%_0402  [RESC1005X40X25NL10T10]
R86  10K_1%_0402  [RESC1005X40X25NL10T10]
R87  10K_1%_0402  [RESC1005X40X25NL10T10]
R88  4.7K_1%_0402  [RESC1005X40X25NL10T10]
R89  4.7K_1%_0402  [RESC1005X40X25NL10T10]
R90  4.7K_1%_0402  [RESC1005X40X25NL10T10]
R91  10K_1%_0402  [RESC1005X40X25NL10T10]
R92  10K_1%_0402  [RESC1005X40X25NL10T10]
R93  10K_1%_0402  [RESC1005X40X25NL10T10]
R100  0_5%_0402  [RESC1005X40X25NL05T10]
R101  0_5%_0402  [RESC1005X40X25NL05T10]
R102  0_5%_0402  [RESC1005X40X25NL05T10]
R103  0_5%_0402  [RESC1005X40X25NL05T10]
R104  0_5%_0402  [RESC1005X40X25NL05T10]
U23  SI5341B-B05071-GM  [QFN64_SI5341_SIL_SKY]
Y1  ABM10-48.000MHZ-E20-T  [FP-ABM10-MFG]

### Nets
GND: C136.1 C137.2 C138.2 C139.2 C140.2 C144.2 C145.2 C146.2 C147.2 C148.2 C149.2 C150.2 C151.2 C152.2 C153.2 C156.2 C157.2 C158.2 C159.2 C160.2 C161.2 C166.2 C169.2 P3.1 P3.2 P6.1 P6.2 R84.1 R93.1 U23.65
P1V8: C140.1 C144.1 C145.1 C146.1 C156.1 C157.1 C158.1 C159.1 C160.1 C161.1 U23.22(VDDO0) U23.32(VDD) U23.36(VDDO4) U23.46(VDD) U23.60(VDD)
P3V3: C147.1 C148.1 C149.1 C150.1 C151.1 C152.1 C153.1 L16.1 R81.2 R85.2 R86.2 R87.2 R88.2 R89.2 R90.2 R91.2 R92.2 U23.26(VDDO1) U23.29(VDDO2) U23.33(VDDO3) U23.40(VDDO5) U23.43(VDDO6) U23.49(VDDO7) U23.52(VDDO8) U23.57(VDDO9)
PLL_VDDA: C138.1 C139.1 L16.2 U23.13(VDDA)
FPGA_CLK: R104.2 ; off-sheet FPGA_CLK
FPGA_CLK2: R103.2 ; off-sheet FPGA_CLK2
HRTIM_EEV2: R69.1 ; off-sheet HRTIM_EEV2
HRTIM_EEV3: R66.1 ; off-sheet HRTIM_EEV3
I2C2_SCL: R88.1 U23.16(SCLK) ; off-sheet I2C2_SCL
I2C2_SDA: R89.1 U23.18(SDA/SDIO) ; off-sheet I2C2_SDA
PLL_A0_CSB: R92.1 U23.19(A0/CSB) ; off-sheet PLL_A0_CSB
PLL_A1_SDO: R91.1 U23.17(A1/SDO) ; off-sheet PLL_A1_SDO
PLL_FB_IN_N: C165.2 R75.2 U23.62(FB_INB) ; off-sheet PLL_FB_IN_N
PLL_FB_IN_P: C163.2 R75.1 U23.61(FB_IN) ; off-sheet PLL_FB_IN_P
PLL_FDEC: U23.25(FDEC) ; off-sheet PLL_FDEC
PLL_FINC: U23.48(FINC) ; off-sheet PLL_FINC
PLL_I2C_SEL: R81.1 R84.2 U23.39(I2C_SEL) ; off-sheet PLL_I2C_SEL
PLL_IN_SEL0: R85.1 U23.3(IN_SEL0) ; off-sheet PLL_IN_SEL0
PLL_IN_SEL1: R86.1 U23.4(IN_SEL1) ; off-sheet PLL_IN_SEL1
PLL_INTRB: R87.1 U23.12(INTRB) ; off-sheet PLL_INTRB
PLL_LOLB: U23.47(LOLB) ; off-sheet PLL_LOLB
PLL_OEB: R93.2 U23.11(OEB) ; off-sheet PLL_OEB
PLL_OUT3_N: C165.1 U23.34(OUT3B) ; off-sheet PLL_OUT3_N
PLL_OUT3_P: C163.1 U23.35(OUT3) ; off-sheet PLL_OUT3_P
PLL_RCB_10M_OUT: R70.1 ; off-sheet PLL_RCB_10M_OUT
PLL_RSTB: R90.1 U23.6(RSTB) ; off-sheet PLL_RSTB
PLL_SPARE: P6.3 R100.2 ; off-sheet PLL_SPARE
PLL_SYNCB: U23.5(SYNCB) ; off-sheet PLL_SYNCB
PLL_UFL_OUT: P3.3 R65.1 ; off-sheet PLL_UFL_OUT
RCB_PLL_10M_IN: C167.2 R82.1 ; off-sheet RCB_PLL_10M_IN
RCB_PLL_10M_IN_C: C168.1 U23.1(IN1) ; off-sheet RCB_PLL_10M_IN_C
SX1276_XTA: R68.2 ; off-sheet SX1276_XTA
SX_XTB: R63.2 ; off-sheet SX_XTB
TCXO_10M: C162.2 R71.1 ; off-sheet TCXO_10M
TCXO_10M_C: C164.1 U23.63(IN0) ; off-sheet TCXO_10M_C
TIM2_ETR: R102.2 ; off-sheet TIM2_ETR
TIM5_ETR: R101.2 ; off-sheet TIM5_ETR
NetC136_2: C136.2 U23.2(IN1B)
NetC137_1: C137.1 U23.64(IN0B)
NetC162_1: C162.1 C164.2 R71.2 R76.2
NetC166_1: C166.1 R76.1
NetC167_1: C167.1 C168.2 R82.2 R83.2
NetC169_1: C169.1 R83.1
NetR63_1: R63.1 R64.1
NetR64_2: R64.2 U23.24(OUT0)
NetR65_2: R65.2 U23.27(OUT1B)
NetR66_2: R66.2 U23.28(OUT1)
NetR67_1: R67.1 R68.1
NetR67_2: R67.2 U23.38(OUT4)
NetR69_2: R69.2 U23.30(OUT2B)
NetR70_2: R70.2 U23.31(OUT2)
NetR100_1: R100.1 U23.59(OUT9)
NetR101_1: R101.1 U23.54(OUT8)
NetR102_1: R102.1 U23.51(OUT7)
NetR103_1: R103.1 U23.45(OUT6)
NetR104_1: R104.1 U23.42(OUT5)
NetU23_7: U23.7(X1) Y1.4(GND)
NetU23_8: U23.8(XA) Y1.1
NetU23_9: U23.9(XB) Y1.3
NetU23_10: U23.10(X2) Y1.2(GND)

Not connected (* = marked no-connect by the designer): U23 14(IN2) 15(IN2B) 20(RSVD) 21(RSVD) 23(OUT0B) 37(OUT4B) 41(OUT5B) 44(OUT6B) 50(OUT7B) 53(OUT8B) 55(RSVD) 56(RSVD) 58(OUT9B)

### Layout directives
differential pair: PLL_FB_IN_N, PLL_FB_IN_P, PLL_OUT3_N, PLL_OUT3_P

### Notes on the sheet
- (near R63) SX1257 36MHz DC coupled LVCMOS 1.8V, extra 0 ohm for possible AC cap
- (near R68) Zero-Delay Feedback
- SX1276 32MHz DC coupled LVCMOS 1.8V, extra 0 ohm for possible AC cap
- Default is I2C
- Default is crystal

### Library data of the parts
C136 C137 C139 C144 C146 C147 C149 C151 C153 C157 C159 C161-C169 = CMP-1034-02068-3: as C3 on sheet 03-WWVB_Path; ComponentLink2URL: https://content.kemet.com/datasheets/KEM_C1002_X7R_SMD.pdf; Automotive: No; Device Class L2: Capacitors; Temperature: -55°C to +125°C; RoHS: TRUE; Voltage Rating: 16 V; ComponentLink2Description: Datasheet; Device Class L3: Ceramic Capacitors; Temperature Range Low: -55°C; Ipc Land Pattern Name: CAPC10050X50; Device Class L1: Passive Components; Temperature Range High: +125°C; Package: C0402-BB; Capacitance: 0.10 μF; Category: Cap; Mouser Description: CAP CER 0.1UF 16V X7R 0402; Height: 0.55mm; Digikey Description: CAP CER 0.1UF 16V 5% X7R 0402; Octopart: https://octopart.com/c0402c104j4ractu-kemet-12573893; Temperature Characteristic: X7R; Lead Free: Yes
C138 C140 C145 C148 C150 C152 C156 C158 C160 = CMP-14477-000104-2: as C10 on sheet 03-WWVB_Path; Packaging: Tape and Reel; Depth: 0.5mm; Mount: Surface Mount; Thickness: 0.022inch; Package Quantity: 1; Min Operating Temperature: -55°C; Series: M; Voltage Rating (DC): 16V; Termination: SMD/SMT; Case/Package: 0402; Number of Pins: 2; Case Code (Imperial): 0402; Length: 1mm; Halogen Free: Halogen Free; Case Code (Metric): 1005; Width: 0.02inch; RoHS Compliant: Yes; Radiation Hardening: No; Max Operating Temperature: 85°C; Height: 0.5mm; Construction: Flat
L16 = CMP-06042-005115-1: Wire Wound RF Inductor 47nH ±5% 440mA 0.648Ω 0402 (1005); Shielding: Unshielded; Core Material: Non-Magnetic; Test Frequency: 100MHz; Q Factor: 25; DC Resistance (DCR): 648mR; Self Resonant Frequency: 3.2GHz; Width: 0.024inch; Packaging: Tape and Reel; Mount: Surface Mount; Resistor Type: Wirewound; Termination: SMD/SMT; Tolerance: 5%; Case Code (Metric): 1005; Min Operating Temperature: -55°C; Current Rating: 440mA; Height: 0.5mm; Max Operating Temperature: 125°C; Case/Package: 0402; Height - Seated (Max): 0.024inch; Length: 0.039inch; Inductance: 47nH; Case Code (Imperial): 0402; Max DC Current: 440mA; Package Quantity: 1
P3 P6 = CMP-2000-05153-1: Ultra Small Coaxial Connector, 6 GHz, -40 to 90 degC, 3-Pin SMD, RoHS, Bulk; Manufacturer: Hirose Electric; Connector Style: U.FL; Impedance: 50Ohm; Dielectric Material: LiquidCrystalPolymer(LCP); Minimum Quantity: UltraMiniatureCoaxial; Online Catalog: U.FLSeries; Featured Product: HiroseU.FLSeries; Frequency - Max: 6GHz; Other Names: H122041 / U.FL-R-SMT-1(01)-ND; Contact Termination: Solder; Body Material: PhosphorBronze; Connector Type: Jack,MalePin; Body Finish: Silver; Center Contact Plating: Gold; Manufacturer URL: https://www.hirose.com; Family: CoaxialConnectors(RF); Fastening Type: Snap-On; Unit PriceUSD: U.FL; Series: U.FL; Package Reference: U.FL-R-SMT; Packaging: Bulk; Standard Package: 100; Mounting Type: SurfaceMount; Quantity Available: Bulk; Housing Color: Silver; Package Description: 3-Pin Surface Mount Device, Body 2.6 x 2.6 mm; Category: Connectors,Interconnects; Operating Temperature: -40degC~90degC; Center Contact Material: PhosphorBronze; Dynamic Catalog: U.FLSeries; Datasheet URL: https://datasheet.ciiva.com/26945/getdatasheetpartid-475239-26945414.pdf; Datasheet Version: Feb-09; Shield Termination: Solder
R63 R68 R71 R76 R82 R83 R100-R104 = CMP-2002-06457-1: as R1 on sheet 02-RCB_Header
R64-R67 R69 R70 = CMP-2002-04448-1: Part Number: RK73H1ETTP49R9F; Manufacturer: KOA Speer
R75 = CMP-2002-07853-1: Manufacturer: Yageo; Part Number: RC0402FR-13100RL
R81 R84-R87 R91-R93 = CMP-2002-04694-1: as R30 on sheet 02-RCB_Header
R88-R90 = CMP-2002-05217-1: Manufacturer: Bourns; Part Number: CR0402-FX-4701GLF
U23 = SI5341B-B05071-GM: No Description Available; Mfr_Name: Skyworks; Type: DEV; Copyright: Copyright (C) 2023 Ultra Librarian. All rights reserved.; Manufacturer_Part_Number: SI5341B-B05071-GM; RefDes: RefDes
Y1 = CMP-27762-011866-1: Crystal 48MHz ±20ppm 10pF SMD-4 2.5mm x 2mm; ESR (Equivalent Series Resistance): 70R; Frequency Tolerance: 20ppm; Depth: 2mm; Height: 0.02inch; RoHS Compliant: Yes; Lead Free: Lead Free; Case/Package: CSMD; Tolerance: 20ppm; Operating Frequency: 48 MHz; Load Capacitance: 10pF; Package Quantity: 1000; Mount: Surface Mount; Number of Pins: 4; Frequency: 48MHz; Length: 2.5mm; Series Resistance: 70R; Packaging: Tape and Reel; Min Operating Temperature: -20°C; Max Operating Temperature: 70°C; Termination: SMD/SMT; Width: 0.079inch; Frequency Stability: 20ppm; Series: ABM10

## Sheet 07-TCXO_Crystal.SchDoc
size B; SheetNumber: 7; SheetTotal: 12
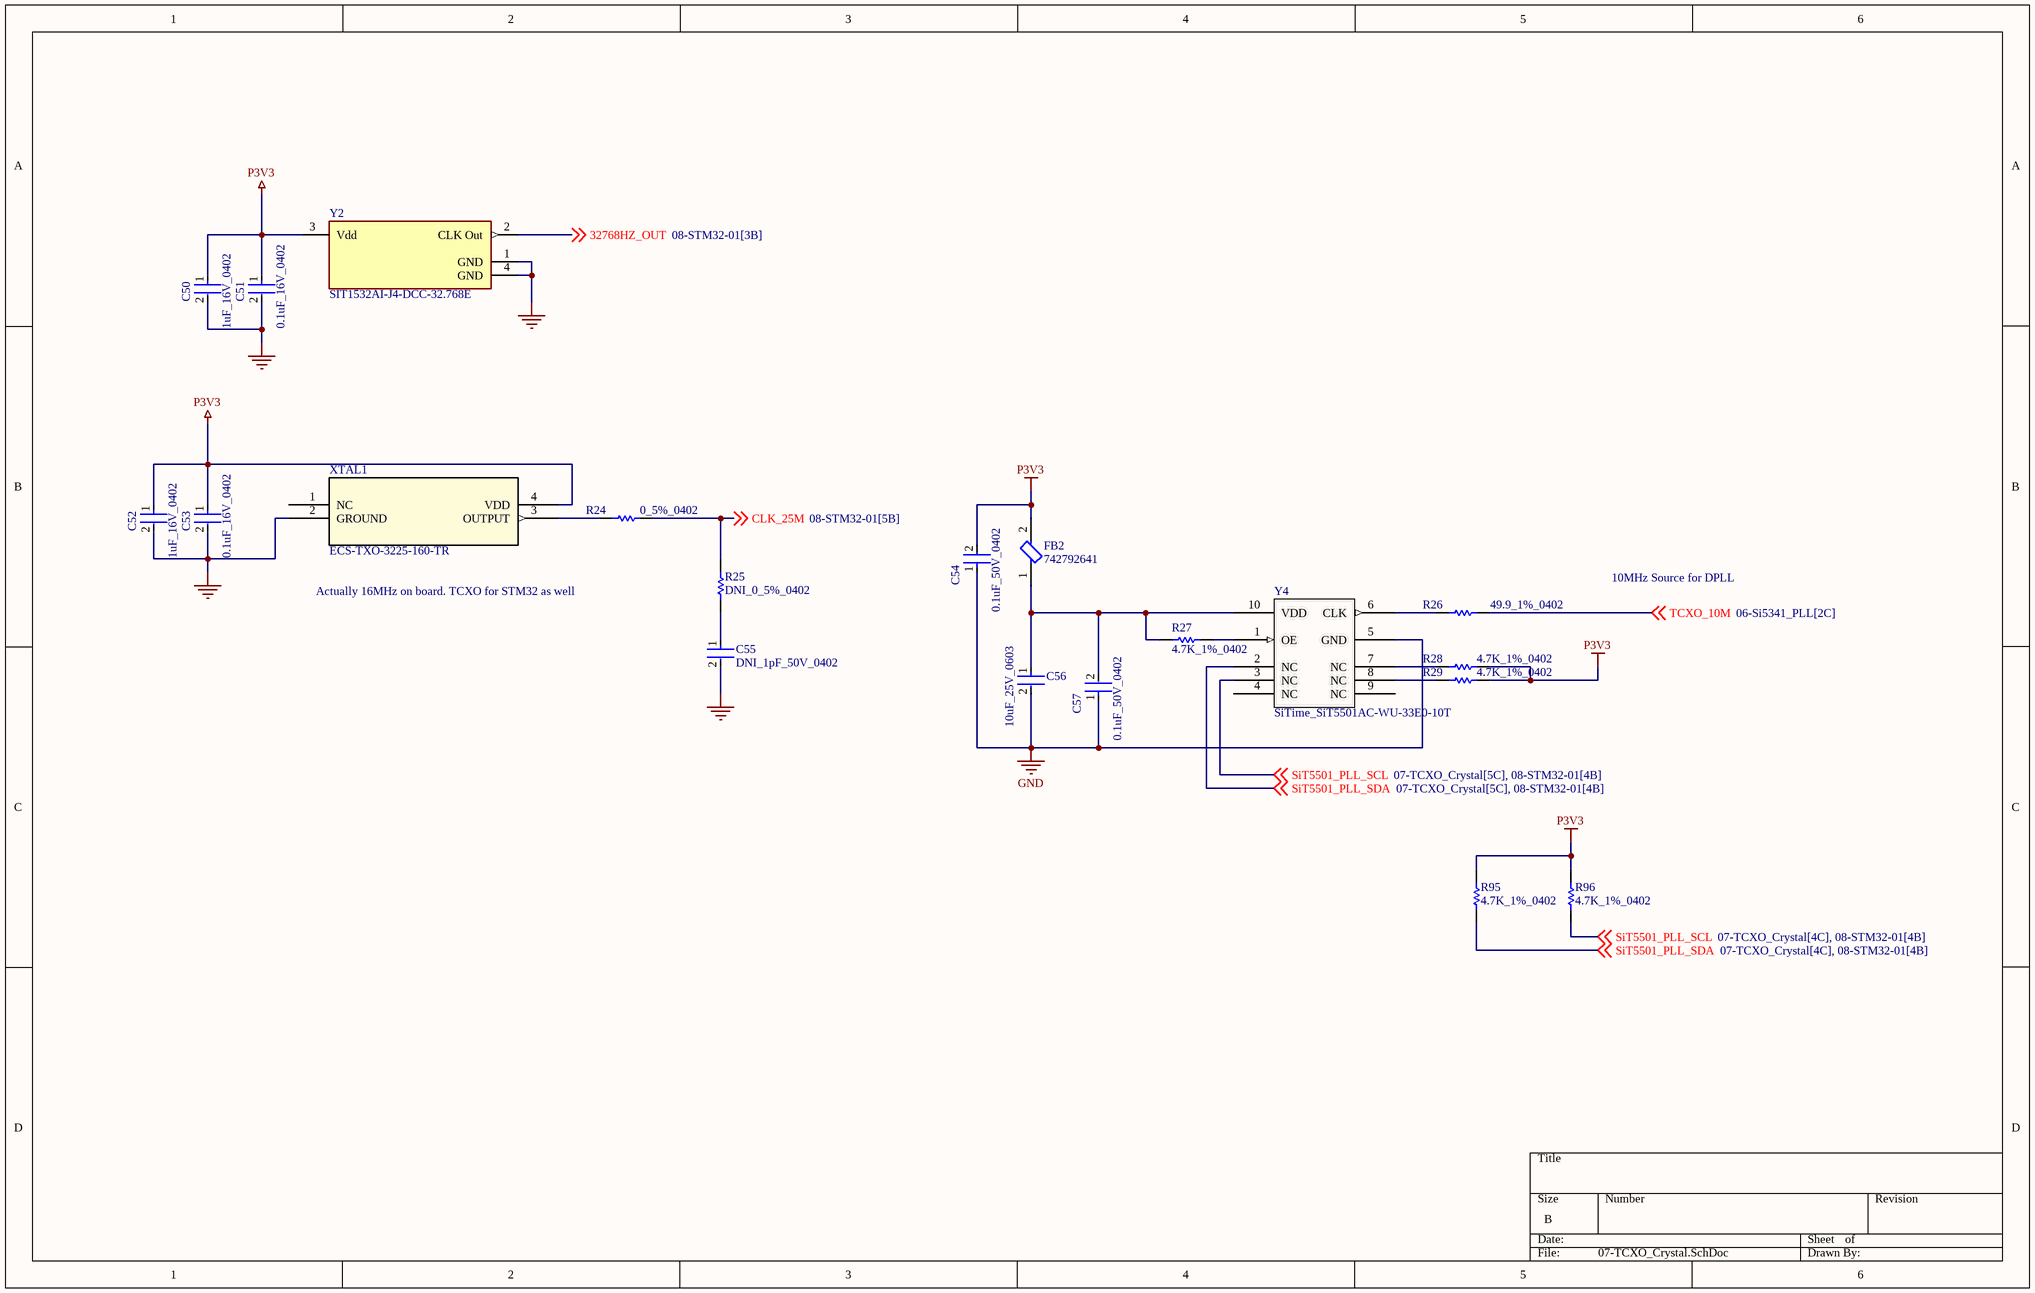
[diagram p4: 07-TCXO_Crystal.SchDoc]

### Parts
C50  1uF_16V_0402  [FP-0402-L_1_0_0_05-W_0_5-IPC_A]
C51  0.1uF_16V_0402  [FP-C0402-BB-MFG]
C52  1uF_16V_0402  [FP-0402-L_1_0_0_05-W_0_5-IPC_A]
C53  0.1uF_16V_0402  [FP-C0402-BB-MFG]
C54  0.1uF_50V_0402  [FP-C1005-050-0_05-IPC_C]
C55  DNI_1pF_50V_0402  [FP-GJM155-0_05-IPC_B]  (no BOM)
C56  10uF_25V_0603  [FP-CL10-IPC_C]
C57  0.1uF_50V_0402  [FP-C1005-050-0_05-IPC_C]
FB2  742792641  [FP-742792641-MFG]
R24  0_5%_0402  [RESC1005X40X25NL05T10]
R25  DNI_0_5%_0402  [RESC1005X40X25NL05T10]  (no BOM)
R26  49.9_1%_0402  [RESC1005X40X25NL10T10]
R27  4.7K_1%_0402  [RESC1005X40X25NL10T10]
R28  4.7K_1%_0402  [RESC1005X40X25NL10T10]
R29  4.7K_1%_0402  [RESC1005X40X25NL10T10]
R95  4.7K_1%_0402  [RESC1005X40X25NL10T10]
R96  4.7K_1%_0402  [RESC1005X40X25NL10T10]
XTAL1  ECS-TXO-3225-160-TR  [ECS-TXO-3225_ECS]
Y2  SIT1532AI-J4-DCC-32.768E  [FP-SIT1532-MFG]
Y4  SiTime_SiT5501AC-WU-33E0-10T  [SITIME_SPL-086-CQFN-010-C07050_REV_DRAFT]

### Nets
GND: C50.2 C51.2 C52.2 C53.2 C54.1 C55.2 C56.2 C57.1 XTAL1.2(GROUND) Y2.1(GND) Y2.4(GND) Y4.5(GND)
P3V3: C50.1 C51.1 C52.1 C53.1 C54.2 FB2.2 R28.2 R29.2 R95.2 R96.2 XTAL1.4(VDD) Y2.3(Vdd)
32768HZ_OUT: Y2.2(CLK_Out) ; off-sheet 32768HZ_OUT
CLK_25M: R24.2 R25.2 ; off-sheet CLK_25M
SiT5501_PLL_SCL: R96.1 Y4.3(NC) ; off-sheet SiT5501_PLL_SCL
SiT5501_PLL_SDA: R95.1 Y4.2(NC) ; off-sheet SiT5501_PLL_SDA
TCXO_10M: R26.1 ; off-sheet TCXO_10M
NetC55_1: C55.1 R25.1
NetC56_1: C56.1 C57.2 FB2.1 R27.1 Y4.10(VDD)
NetR24_1: R24.1 XTAL1.3(OUTPUT)
NetR26_2: R26.2 Y4.6(CLK)
NetR27_2: R27.2 Y4.1(OE)
NetR28_1: R28.1 Y4.7(NC)
NetR29_1: R29.1 Y4.8(NC)

Not connected (* = marked no-connect by the designer): XTAL1 1(NC); Y4 4(NC) 9(NC)

### Notes on the sheet
- Actually 16MHz on board. TCXO for STM32 as well
- 10MHz Source for DPLL

### Library data of the parts
C50 C52 = CMP-14477-000104-2: as C10 on sheet 03-WWVB_Path; Packaging: Tape and Reel; Depth: 0.5mm; Mount: Surface Mount; Thickness: 0.022inch; Package Quantity: 1; Min Operating Temperature: -55°C; Series: M; Voltage Rating (DC): 16V; Termination: SMD/SMT; Case/Package: 0402; Number of Pins: 2; Case Code (Imperial): 0402; Length: 1mm; Halogen Free: Halogen Free; Case Code (Metric): 1005; Width: 0.02inch; RoHS Compliant: Yes; Radiation Hardening: No; Max Operating Temperature: 85°C; Height: 0.5mm; Construction: Flat
C51 C53 = CMP-1034-02068-3: as C3 on sheet 03-WWVB_Path; ComponentLink2URL: https://content.kemet.com/datasheets/KEM_C1002_X7R_SMD.pdf; Automotive: No; Device Class L2: Capacitors; Temperature: -55°C to +125°C; RoHS: TRUE; Voltage Rating: 16 V; ComponentLink2Description: Datasheet; Device Class L3: Ceramic Capacitors; Temperature Range Low: -55°C; Ipc Land Pattern Name: CAPC10050X50; Device Class L1: Passive Components; Temperature Range High: +125°C; Package: C0402-BB; Capacitance: 0.10 μF; Category: Cap; Mouser Description: CAP CER 0.1UF 16V X7R 0402; Height: 0.55mm; Digikey Description: CAP CER 0.1UF 16V 5% X7R 0402; Octopart: https://octopart.com/c0402c104j4ractu-kemet-12573893; Temperature Characteristic: X7R; Lead Free: Yes
C54 C57 = CMP-2000-05393-2: Multilayer Ceramic Capacitors 100nF ±10% 50V X7R SMD 0402; Voltage: 50V; Dielectric Material: Ceramic; Min Operating Temperature: -55°C; Depth: 0.5mm; Radiation Hardening: No; RoHS Compliant: Yes; Voltage Rating (DC): 50V; Lead Free: Lead Free; Resistor Type: Ceramic; Height: 0.5mm; Dielectric: X7R; Thickness: 0.022inch; Case/Package: 0402; Case Code (Metric): 1005; Termination: SMD/SMT; Capacitance: 100nF; Packaging: Tape and Reel; Max Operating Temperature: 125°C; Mount: Surface Mount; Package Quantity: 1; Width: 0.02inch; Weight: 2.3E-05oz; Voltage Rating: 50V; Tolerance: 10%; Construction: Flat; Case Code (Imperial): 0402; Length: 1mm; REACH SVHC: No SVHC; Series: C
C55 = CMP-2008-03808-2: Multi-Layer Ceramic Capacitor 1pF C0G  ±0.1pF 0402 Paper T/R; Temperature Coefficient: 30ppm/°C; Voltage Rating (DC): 50V; REACH SVHC: No SVHC; Packaging: Tape and Reel; Width: 0.02inch; Package Quantity: 10000; Min Operating Temperature: -55°C; Case Code (Imperial): 0402; Lead Pitch: 0.3mm; Capacitance: 1pF; Length: 1mm; Max Operating Temperature: 125°C; Depth: 0.5mm; Thickness: 0.022inch; Case Code (Metric): 1005; Lead Free: Lead Free; Voltage: 50V; Mount: Surface Mount; Number of Pins: 2; Termination: SMD/SMT; Radiation Hardening: No; Dielectric: C0G; Case/Package: 0402; Voltage Rating: 50V; Height: 0.5mm
C56 = CMP-13271-004224-1: Cap Ceramic 10uF 25V X5R ±20% Pad SMD 0603 +85°C T/R; Width: 0.031inch; Voltage Rating: 25V; Length: 0.063inch; Case Code (Metric): 1608; Dielectric: X5R; Termination: Wraparound; Capacitance: 10uF; Lead Free: Lead Free; Mount: Surface Mount; Package Quantity: 1; Case Code (Imperial): 0603; Thickness: 0.035inch; Packaging: Tape and Reel; Contact Plating: Tin; Min Operating Temperature: -55°C; Tolerance: 20%; Max Operating Temperature: 85°C; Case/Package: 0603
FB2 = CMP-0220-00171-2: FERRITE BEAD 300 OHM 0603 1LN; Inductance: 18nH; Max DC Current: 2A; Number of Lines: 1; Test Frequency: 100MHz; Impedance: 300R; DC Resistance (DCR): 150mR; Tolerance: 25%; Case Code (Metric): 1608; Core Material: Ferrite; Length: 1.6mm; Lead Free: Lead Free; Series: WE-CBF; Min Operating Temperature: -55°C; RoHS Compliant: Yes; Case/Package: SMD/SMT; Material: Ferrite; Max Operating Temperature: 125°C; Termination: SMD/SMT; Packaging: Tape and Reel; Weight: 0.000141oz; Case Code (Imperial): 0603; Width: 0.8mm; Mount: Surface Mount; Max Current Rating: 2A; Package Quantity: 1; Depth: 0.8mm; Current Rating: 2A; Height: 0.8mm
R24 R25 = CMP-2002-06457-1: as R1 on sheet 02-RCB_Header
R26 = CMP-2002-04448-1: as R64 on sheet 06-Si5341_PLL
R27-R29 R95 R96 = CMP-2002-05217-1: as R88 on sheet 06-Si5341_PLL
XTAL1 = ECS-TXO-3225-122.8-TR: No Description Available; Mfr_Name: ECS International; RefDes: RefDes; Type: Type; Supplier 1: Newark; Supplier Part Number 1: 54AK5779
Y2 = CMP-25159-261190-1: MEMS OSC XO 32.7680KHZ LVCMOS; Max Supply Voltage: 3.63V; Current Rating: 1.35uA; Frequency Stability: 100ppm; Frequency: 32.768kHz; Max Supply Current: 1.4uA; Load Capacitance: 10pF; Max Duty Cycle: 52%; Min Supply Voltage: 1.5V; Length: 1.5mm; Max Operating Temperature: 85°C; Packaging: Tape and Reel; Termination: SMD/SMT; Min Operating Temperature: -40°C; RoHS Compliant: Yes; Width: 0.8mm; Package Quantity: 1000; Lead Free: Lead Free; Mount: Surface Mount; Height: 0.6mm; Series: SiT1532
Y4 = CMP-OSC-00029-2: OSC, MEMS, STRATUM 3E, 10.000MHZ, 10PPB STAB, LVCMOS, 3.3V, O/P EN, 7.0X5.0X2.2MM, CQFN-10; Manufacturer Part Number: SiT5501AI-WU033JH-10.000000; Manufacturer: SiTime; Frequency: 10 MHz; Voltage - Supply: 3.3 V; Type: OCXO; Category: Oscillators; Max Operating Temperature: 70°C; Min Operating Temperature: -20°C; Height: 2.20mm (max); Case/Package: 10 Lead QFN; Output: LVCMOS; Mounting Type: Surface Mount; Frequency Stability: ±10 ppb; RoHS: Yes

## Sheet 09-STM32-02.SchDoc
size B; SheetNumber: 9; SheetTotal: 12
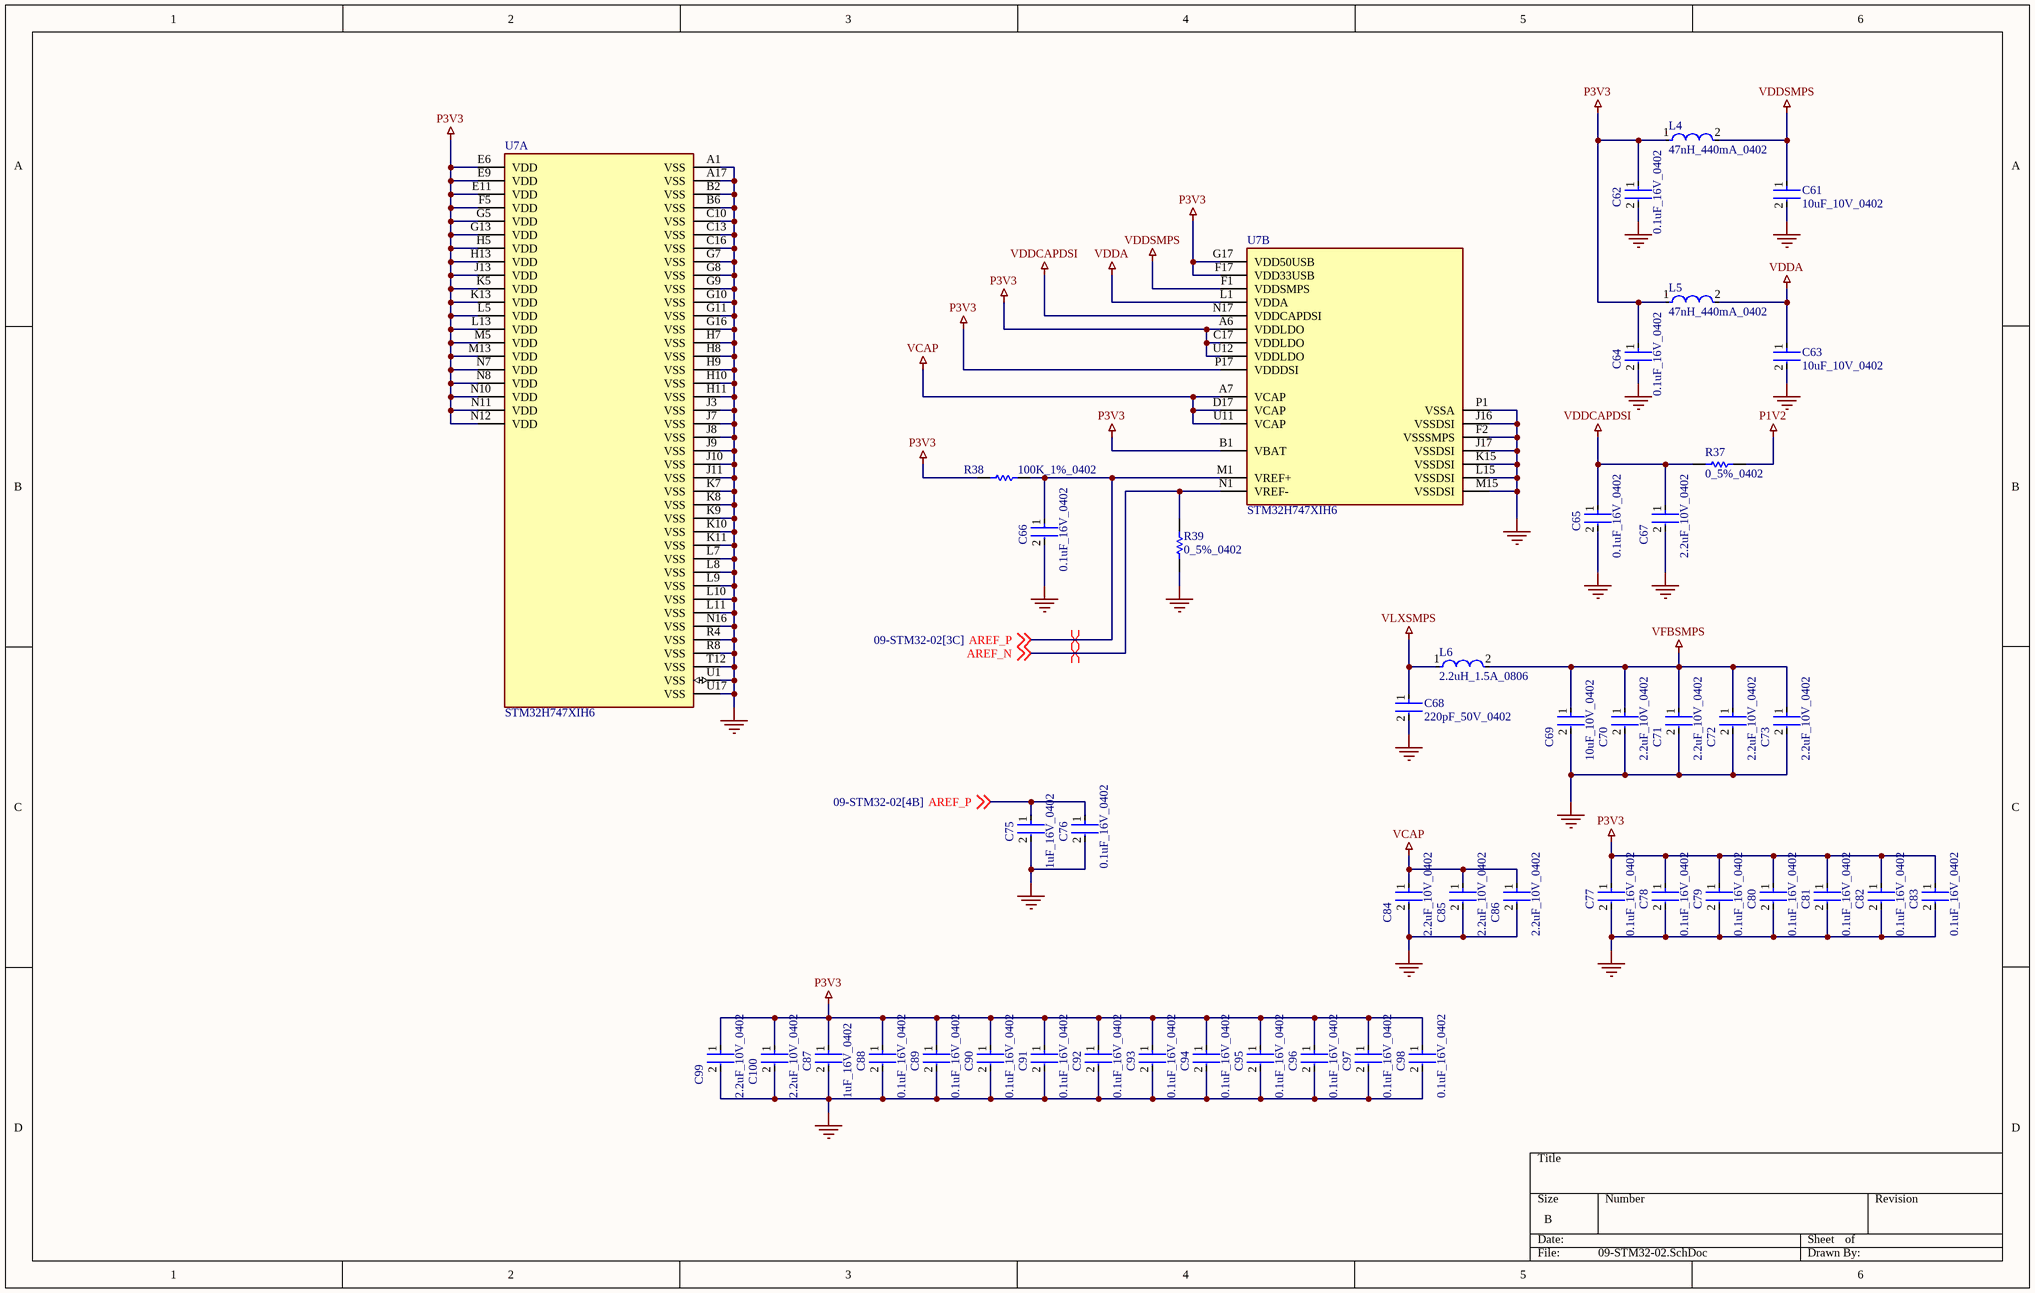
[diagram p5: 09-STM32-02.SchDoc]

### Parts
C61  10uF_10V_0402  [FP-CL05A106MP5NUNC-MFG]
C62  0.1uF_16V_0402  [FP-C0402-BB-MFG]
C63  10uF_10V_0402  [FP-CL05A106MP5NUNC-MFG]
C64  0.1uF_16V_0402  [FP-C0402-BB-MFG]
C65  0.1uF_16V_0402  [FP-C0402-BB-MFG]
C66  0.1uF_16V_0402  [FP-C0402-BB-MFG]
C67  2.2uF_10V_0402  [FP-C1005-050-0_15-0_1-MFG]
C68  220pF_50V_0402  [FP-GCM155-0_05-IPC_C]
C69  10uF_10V_0402  [FP-CL05A106MP5NUNC-MFG]
C70  2.2uF_10V_0402  [FP-C1005-050-0_15-0_1-MFG]
C71  2.2uF_10V_0402  [FP-C1005-050-0_15-0_1-MFG]
C72  2.2uF_10V_0402  [FP-C1005-050-0_15-0_1-MFG]
C73  2.2uF_10V_0402  [FP-C1005-050-0_15-0_1-MFG]
C75  1uF_16V_0402  [FP-0402-L_1_0_0_05-W_0_5-IPC_A]
C76  0.1uF_16V_0402  [FP-C0402-BB-MFG]
C77  0.1uF_16V_0402  [FP-C0402-BB-MFG]
C78  0.1uF_16V_0402  [FP-C0402-BB-MFG]
C79  0.1uF_16V_0402  [FP-C0402-BB-MFG]
C80  0.1uF_16V_0402  [FP-C0402-BB-MFG]
C81  0.1uF_16V_0402  [FP-C0402-BB-MFG]
C82  0.1uF_16V_0402  [FP-C0402-BB-MFG]
C83  0.1uF_16V_0402  [FP-C0402-BB-MFG]
C84  2.2uF_10V_0402  [FP-C1005-050-0_15-0_1-MFG]
C85  2.2uF_10V_0402  [FP-C1005-050-0_15-0_1-MFG]
C86  2.2uF_10V_0402  [FP-C1005-050-0_15-0_1-MFG]
C87  1uF_16V_0402  [FP-0402-L_1_0_0_05-W_0_5-IPC_A]
C88  0.1uF_16V_0402  [FP-C0402-BB-MFG]
C89  0.1uF_16V_0402  [FP-C0402-BB-MFG]
C90  0.1uF_16V_0402  [FP-C0402-BB-MFG]
C91  0.1uF_16V_0402  [FP-C0402-BB-MFG]
C92  0.1uF_16V_0402  [FP-C0402-BB-MFG]
C93  0.1uF_16V_0402  [FP-C0402-BB-MFG]
C94  0.1uF_16V_0402  [FP-C0402-BB-MFG]
C95  0.1uF_16V_0402  [FP-C0402-BB-MFG]
C96  0.1uF_16V_0402  [FP-C0402-BB-MFG]
C97  0.1uF_16V_0402  [FP-C0402-BB-MFG]
C98  0.1uF_16V_0402  [FP-C0402-BB-MFG]
C99  2.2uF_10V_0402  [FP-C1005-050-0_15-0_1-MFG]
C100  2.2uF_10V_0402  [FP-C1005-050-0_15-0_1-MFG]
L4  47nH_440mA_0402  [FP-LQW15AN_80-MFG]
L5  47nH_440mA_0402  [FP-LQW15AN_80-MFG]
L6  2.2uH_1.5A_0806  [FP-DFE201612C-MFG]
R37  0_5%_0402  [RESC1005X40X25NL05T10]
R38  100K_1%_0402  [RESC1005X40X25ML05T10]
R39  0_5%_0402  [RESC1005X40X25NL05T10]
U7  STM32H747XIH6  [FP-TFBGA240+25-A07U-MFG]  (parts A,B of 5)

### Nets
GND: C61.2 C62.2 C63.2 C64.2 C65.2 C66.2 C67.2 C68.2 C69.2 C70.2 C71.2 C72.2 C73.2 C75.2 C76.2 C77.2 C78.2 C79.2 C80.2 C81.2 C82.2 C83.2 C84.2 C85.2 C86.2 C87.2 C88.2 C89.2 C90.2 C91.2 C92.2 C93.2 C94.2 C95.2 C96.2 C97.2 C98.2 C99.2 C100.2 R39.1 U7.A1(VSS) U7.A17(VSS) U7.B2(VSS) U7.B6(VSS) U7.C10(VSS) U7.C13(VSS) U7.C16(VSS) U7.F2(VSSSMPS) U7.G7(VSS) U7.G8(VSS) U7.G9(VSS) U7.G10(VSS) U7.G11(VSS) U7.G16(VSS) U7.H7(VSS) U7.H8(VSS) U7.H9(VSS) U7.H10(VSS) U7.H11(VSS) U7.J3(VSS) U7.J7(VSS) U7.J8(VSS) U7.J9(VSS) U7.J10(VSS) U7.J11(VSS) U7.J16(VSSDSI) U7.J17(VSSDSI) U7.K7(VSS) U7.K8(VSS) U7.K9(VSS) U7.K10(VSS) U7.K11(VSS) U7.K15(VSSDSI) U7.L7(VSS) U7.L8(VSS) U7.L9(VSS) U7.L10(VSS) U7.L11(VSS) U7.L15(VSSDSI) U7.M15(VSSDSI) U7.N16(VSS) U7.P1(VSSA) U7.R4(VSS) U7.R8(VSS) U7.T12(VSS) U7.U1(VSS) U7.U17(VSS)
P1V2: R37.1
P3V3: C62.1 C64.1 C77.1 C78.1 C79.1 C80.1 C81.1 C82.1 C83.1 C87.1 C88.1 C89.1 C90.1 C91.1 C92.1 C93.1 C94.1 C95.1 C96.1 C97.1 C98.1 C99.1 C100.1 L4.1 L5.1 R38.1 U7.A6(VDDLDO) U7.B1(VBAT) U7.C17(VDDLDO) U7.E6(VDD) U7.E9(VDD) U7.E11(VDD) U7.F5(VDD) U7.F17(VDD33USB) U7.G5(VDD) U7.G13(VDD) U7.G17(VDD50USB) U7.H5(VDD) U7.H13(VDD) U7.J13(VDD) U7.K5(VDD) U7.K13(VDD) U7.L5(VDD) U7.L13(VDD) U7.M5(VDD) U7.M13(VDD) U7.N7(VDD) U7.N8(VDD) U7.N10(VDD) U7.N11(VDD) U7.N12(VDD) U7.P17(VDDDSI) U7.U12(VDDLDO)
VCAP: C84.1 C85.1 C86.1 U7.A7(VCAP) U7.D17(VCAP) U7.U11(VCAP)
VDDA: C63.1 L5.2 U7.L1(VDDA)
VDDCAPDSI: C65.1 C67.1 R37.2 U7.N17(VDDCAPDSI)
VDDSMPS: C61.1 L4.2 U7.F1(VDDSMPS)
VFBSMPS: C69.1 C70.1 C71.1 C72.1 C73.1 L6.2
VLXSMPS: C68.1 L6.1
AREF_N: R39.2 U7.N1(VREF-) ; off-sheet AREF_N
AREF_P: C66.1 C75.1 C76.1 R38.2 U7.M1(VREF+) ; off-sheet AREF_P

### Layout directives
differential pair: AREF_N, AREF_P

### Library data of the parts
C61 C63 C69 = CMP-13271-000002-1: as C125 on sheet 03-WWVB_Path; Octopart: https://octopart.com/cl05a106mp5nunc-samsung-22457395; Voltage Rating: 10V; RoHS: TRUE; Value: 10uF; Height: 0.7mm; Digikey Description: CAP CER 10UF 10V X5R 0402; Automotive: No; Package: CL05A106MP5NUNC; Device Class L1: Passive Components; Capacitance: 10uF; Temperature Range High: +85°C; ComponentLink2Description: Datasheet; Device Class L2: Capacitors; Temperature Characteristic: X5R; Temperature: -55°C to +85°C; ComponentLink2URL: http://www.samsungsem.com/kr/support/product-search/mlcc/__icsFiles/afieldfile/2019/05/10/19-CL05A106MP5NUNC.pdf; Device Class L3: Ceramic Capacitors; Category: Cap; Temperature Range Low: -55°C; Ipc Land Pattern Name: CAPC10050X50; Lead Free: Yes
C62 C64-C66 C76-C83 C88-C98 = CMP-1034-02068-3: as C3 on sheet 03-WWVB_Path; ComponentLink2URL: https://content.kemet.com/datasheets/KEM_C1002_X7R_SMD.pdf; Automotive: No; Device Class L2: Capacitors; Temperature: -55°C to +125°C; RoHS: TRUE; Voltage Rating: 16 V; ComponentLink2Description: Datasheet; Device Class L3: Ceramic Capacitors; Temperature Range Low: -55°C; Ipc Land Pattern Name: CAPC10050X50; Device Class L1: Passive Components; Temperature Range High: +125°C; Package: C0402-BB; Capacitance: 0.10 μF; Category: Cap; Mouser Description: CAP CER 0.1UF 16V X7R 0402; Height: 0.55mm; Digikey Description: CAP CER 0.1UF 16V 5% X7R 0402; Octopart: https://octopart.com/c0402c104j4ractu-kemet-12573893; Temperature Characteristic: X7R; Lead Free: Yes
C67 C70-C73 C84-C86 C99 C100 = CMP-08246-004344-1: CAP CER 2.2UF 10V X7S 0402; Dielectric Material: Ceramic; Tolerance: 10%; Mount: Surface Mount; Height: 0.5mm; Package Quantity: 1; Depth: 0.5mm; RoHS Compliant: Yes; Length: 1mm; Thickness: 0.022inch; Packaging: Tape and Reel; Capacitance: 2.2uF; Case Code (Imperial): 0402; Resistor Type: Ceramic; Dielectric: X7S; Case/Package: 0402; Min Operating Temperature: -55°C; Voltage Rating: 10V; Series: C; Weight: 2.3E-05oz; Width: 0.02inch; Voltage Rating (DC): 10V; Case Code (Metric): 1005; Max Operating Temperature: 125°C; Termination: SMD/SMT; Lead Free: Lead Free
C68 = CMP-2008-03726-2: Ceramic Capacitor for Automotive 220pF ±10% 50VDC X7R 0402 Paper T/R; Voltage Rating (DC): 50V; Width: 0.02inch; Depth: 0.5mm; Package Quantity: 1; Min Operating Temperature: -55°C; Max Operating Temperature: 125°C; Mount: Surface Mount; Length: 1mm; Case/Package: 0402; Case Code (Metric): 1005; Ratings: AEC-Q200; Tolerance: 10%; Radiation Hardening: No; Termination: SMD/SMT; Voltage: 50V; Dielectric: X7R; Voltage Rating: 50V; Case Code (Imperial): 0402; Capacitance: 220pF; Packaging: Tape and Reel; Thickness: 0.022inch; Height: 0.5mm
C75 C87 = CMP-14477-000104-2: as C10 on sheet 03-WWVB_Path; Packaging: Tape and Reel; Depth: 0.5mm; Mount: Surface Mount; Thickness: 0.022inch; Package Quantity: 1; Min Operating Temperature: -55°C; Series: M; Voltage Rating (DC): 16V; Termination: SMD/SMT; Case/Package: 0402; Number of Pins: 2; Case Code (Imperial): 0402; Length: 1mm; Halogen Free: Halogen Free; Case Code (Metric): 1005; Width: 0.02inch; RoHS Compliant: Yes; Radiation Hardening: No; Max Operating Temperature: 85°C; Height: 0.5mm; Construction: Flat
L4 L5 = CMP-06042-005115-1: as L16 on sheet 06-Si5341_PLL; Width: 0.024inch; Packaging: Tape and Reel; Mount: Surface Mount; Resistor Type: Wirewound; Termination: SMD/SMT; Tolerance: 5%; Case Code (Metric): 1005; Min Operating Temperature: -55°C; Current Rating: 440mA; Height: 0.5mm; Max Operating Temperature: 125°C; Case/Package: 0402; Height - Seated (Max): 0.024inch; Length: 0.039inch; Inductance: 47nH; Case Code (Imperial): 0402; Max DC Current: 440mA; Package Quantity: 1
L6 = CMP-06042-007475-1: Shielded Wirewound Inductor 2.2uH 20% 1500mA 0.144Ω 0806 (2016); Core Material: Ferrite; Test Frequency: 1MHz; Current Rating: 2.1A; DC Resistance (DCR): 144mR; Max DC Current: 1.5A; Tolerance: 20%; Length: 0.079inch; Packaging: Tape and Reel; Max Operating Temperature: 125°C; Min Operating Temperature: -40°C; Case/Package: 0806; Case Code (Imperial): 0806; Inductance: 2.2uH; Mount: Surface Mount; Width: 0.063inch; Resistor Type: Wirewound; Case Code (Metric): 2016; Shielding: Shielded; Depth: 1.6mm; Height - Seated (Max): 0.039inch
R37 R39 = CMP-2002-06457-1: as R1 on sheet 02-RCB_Header
R38 = CMP-2002-07852-1: as R22 on sheet 02-RCB_Header
U7 = CMP-12105-000055-1: HIGH-PERFORMANCE AND DSP WITH DP; Manufacturer: STMicroelectronics; Number Of Uart Channels: 9; Number Of Pwm Channels: 2; Memory Size: 2MBytes; Number Of Ethernet Channels: 1; Ram Size: 1MBytes; Number Of Timers/Counters: 22; Data Bus Width: 32bits; Core Architecture: ARM Cortex-M4, ARM Cortex-M7; Interface: I2C,SPI,UART,USART,CAN,USB,LIN,IrDA,Ethernet,I2S,SMBus,Other; Number Of Adc Channels: 36; Min Supply Voltage: 1.2V; Number Of A/D Converters: 3; Number Of Spi Channels: 6; Max Supply Voltage: 3.6V; Frequency: 480MHz; Memory Type: FLASH; Number Of I2C Channels: 4; Max Junction Temp: +125°C; Standoff Height: 0.15mm; Number Of I/Os: 168; Device Class L2: Embedded Processors and Controllers; Digikey Description: HIGH-PERFORMANCE AND DSP WITH DP; RoHS: TRUE; Lead Free: Yes; Manufacturer Part Number: STM32H747XIH6; ComponentLink2URL: https://www.st.com/resource/en/datasheet/stm32h747xi.pdf; Mouser Description: STM32 Series 2 MB Flash 1 MB RAM 480 MHz 32-Bit Microcontroller - TFBGA-265; Device Class L1: Integrated Circuits (ICs); Ipc Land Pattern Name: BGA289N80P17X17_1400X1400X110; Category: IC; Device Class L3: Microcontrollers; Ambient Temperature Range High: +85°C; Number Of Cores: 2; Temperature Range High: +125°C; ComponentLink2Description: Datasheet; Automotive: No; Ambient Temperature Range Low: -40°C; Package: TFBGA240+25-A07U; Temperature: -40°C to +125°C; Number Of Usb Channels: 2; Temperature Range Low: -40°C; Height: 1.1mm; Octopart: https://octopart.com/stm32h747xih6-stmicroelectronics-100293943